# Altium project ECTU.PrjPcb
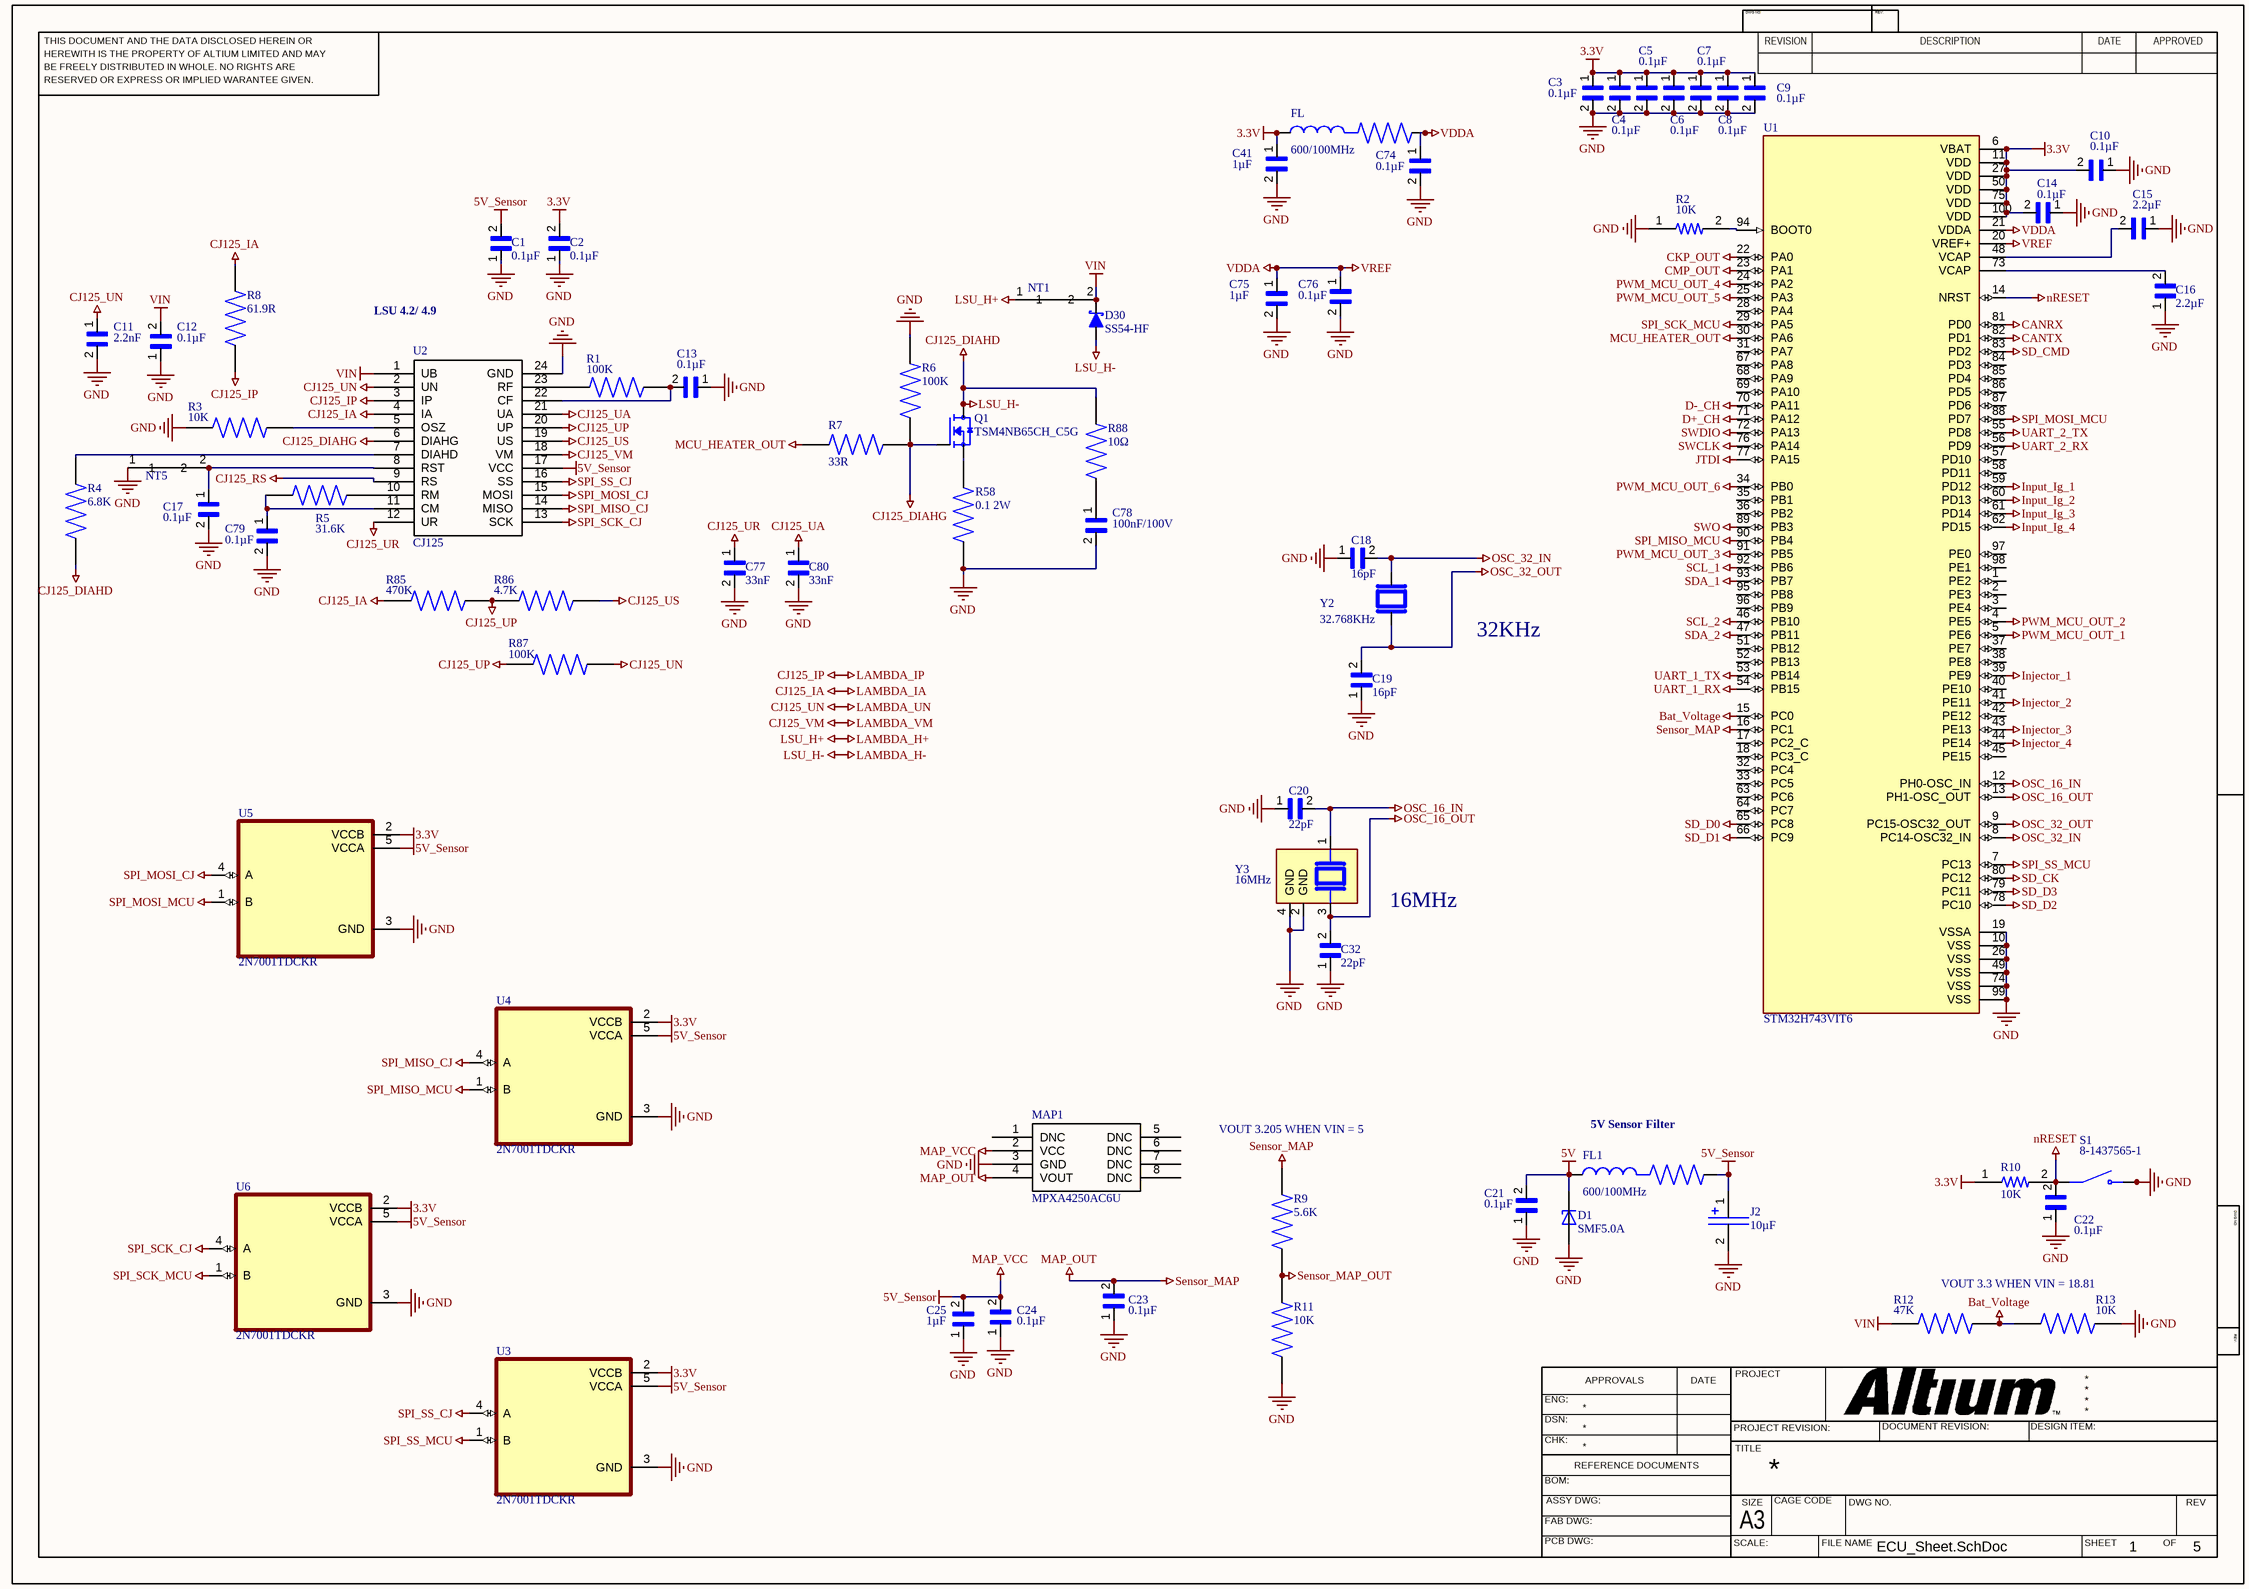
[diagram p0: ECU_Sheet.SchDoc]
5 sheets, 273 parts. Net scope: global (net labels, ports and power ports of the same name join across sheets).
Board file: ECTU_PCB.PcbDoc
Sheets:
  ECU_Sheet.SchDoc
  Communication_Interfaces.SchDoc
  Outputs_Sensors_And_ECUConnector.SchDoc
  Ignition_Injector.SchDoc
  CKP_CMP.SchDoc

## Sheet ECU_Sheet.SchDoc
size 420 x 297 mm; SheetNumber: 1; SheetTotal: 5

### Parts
C1  0.1µF  [CAPC1608X90N]
C2  0.1µF  [CAPC1608X90N]
C3  0.1µF  [CAPC1608X90N]
C4  0.1µF  [CAPC1608X90N]
C5  0.1µF  [CAPC1608X90N]
C6  0.1µF  [CAPC1608X90N]
C7  0.1µF  [CAPC1608X90N]
C8  0.1µF  [CAPC1608X90N]
C9  0.1µF  [CAPC1608X90N]
C10  0.1µF  [CAPC1608X90N]
C11  2.2nF  [CAPC1608X90N]
C12  0.1µF  [CAPC1608X90N]
C13  0.1µF  [CAPC1608X90N]
C14  0.1µF  [CAPC1608X90N]
C15  2.2µF  [CAPC1608X90N]
C16  2.2µF  [CAPC1608X90N]
C17  0.1µF  [CAPC1608X90N]
C18  16pF  [CAPC1608X90N]
C19  16pF  [CAPC1608X90N]
C20  22pF  [CAPC1608X90N]
C21  0.1µF  [CAPC1608X90N]
C22  0.1µF  [CAPC1608X90N]
C23  0.1µF  [CAPC1608X90N]
C24  0.1µF  [CAPC1608X90N]
C25  1µF  [CAPC1608X90N]
C32  22pF  [CAPC1608X90N]
C41  1µF  [CAPC1608X90N]
C74  0.1µF  [CAPC1608X90N]
C75  1µF  [CAPC1608X90N]
C76  0.1µF  [CAPC1608X90N]
C77  33nF  [CAPC1608X90N]
C78  100nF/100V  [CAPC1608X90N]
C79  0.1µF  [CAPC1608X90N]
C80  33nF  [CAPC1608X90N]
D1  SMF5.0A  [SODFL3718X102N]
D30  SS54-HF  [DIOM5025X220N]
FL  600/100MHz  [BEADC1608X95N]
FL1  600/100MHz  [BEADC1608X95N]
J2  10µF  [T491A106K010AT]
MAP1  MPXA4250AC6U  [SOIC127P1041X990-8N]
NT1  (no value)  [NetTie]  (net tie, no BOM)
NT5  NT  [NetTie]  (value not drawn)  (net tie, no BOM)
Q1  TSM4NB65CH_C5G  [TO228P680X240X837-3]
R1  100K  [RESC3116X65N]
R2  10K  [RESC1608X50N]
R3  10K  [RESC3116X65N]
R4  6.8K  [RESC3116X65N]
R5  31.6K  [RESC3116X65N]
R6  100K  [RESC3116X65N]
R7  33R  [RESC3116X65N]
R8  61.9R  [RESC3116X65N]
R9  5.6K  [RESC3116X65N]
R10  10K  [RESC1608X50N]
R11  10K  [RESC3116X65N]
R12  47K  [RESC3116X65N]
R13  10K  [RESC3116X65N]
R58  0.1 2W  [RESC6331X80N]
R85  470K  [RESC3116X65N]
R86  4.7K  [RESC3116X65N]
R87  100K  [RESC3116X65N]
R88  10Ω  [RESC3116X65N]
S1  8-1437565-1  [SW_8-1437565-1]
U1  STM32H743VIT6  [QFP50P1600X1600X160-100N]
U2  CJ125  [CJ125]
U3  2N7001TDCKR  [SOT65P210X110-5N]
U4  2N7001TDCKR  [SOT65P210X110-5N]
U5  2N7001TDCKR  [SOT65P210X110-5N]
U6  2N7001TDCKR  [SOT65P210X110-5N]
Y2  32.768KHz  [XTAL_ABS06-32.768KHZ-9-1-T]
Y3  16MHz  [XTAL_7M25090002]

### Nets
3.3V: C2.2 C3.1 C4.1 C5.1 C6.1 C7.1 C8.1 C9.1 C10.2 C14.2 C41.1 FL.1 R10.1 U1.6(VBAT) U1.11(VDD) U1.27(VDD) U1.50(VDD) U1.75(VDD) U1.100(VDD) U3.2(VCCB) U4.2(VCCB) U5.2(VCCB) U6.2(VCCB)
5V: C21.2 D1.C FL1.1
5V_Sensor: C1.2 C24.2 C25.2 FL1.2 J2.1(P$1) MAP1.2(VCC) U2.17(VCC) U3.5(VCCA) U4.5(VCCA) U5.5(VCCA) U6.5(VCCA)  [also labelled MAP_VCC]
Bat_Voltage: R12.2 R13.1 U1.15(PC0)
CANRX: U1.81(PD0)
CANTX: U1.82(PD1)
CJ125_DIAHD: D30.2(A) Q1.2(D) R4.1 R88.2  [also labelled LAMBDA_H-, LSU_H-]
CJ125_DIAHG: Q1.1(G) R6.1 R7.2 U2.6(DIAHG)
CJ125_IA: R8.1 R85.1 U2.4(IA)  [also labelled LAMBDA_IA]
CJ125_IP: R8.2 U2.3(IP)  [also labelled LAMBDA_IP]
CJ125_RS: U2.9(RS)
CJ125_UA: C80.1 U2.21(UA)
CJ125_UN: C11.1 R87.2 U2.2(UN)  [also labelled LAMBDA_UN]
CJ125_UP: R85.2 R86.1 R87.1 U2.20(UP)
CJ125_UR: C77.1 U2.12(UR)
CJ125_US: R86.2 U2.19(US)
CJ125_VM: U2.18(VM)  [also labelled LAMBDA_VM]
CKP_OUT: U1.22(PA0)
CMP_OUT: U1.23(PA1)
D+_CH: U1.71(PA12)
D-_CH: U1.70(PA11)
GND: C1.1 C2.1 C3.2 C4.2 C5.2 C6.2 C7.2 C8.2 C9.2 C10.1 C11.2 C12.1 C13.1 C14.1 C15.1 C16.1 C17.2 C18.1 C19.1 C20.1 C21.1 C22.1 C23.1 C24.1 C25.1 C32.1 C41.2 C74.2 C75.2 C76.2 C77.2 C78.2 C79.2 C80.2 D1.A J2.2(P$2) MAP1.3(GND) NT5.1 R2.1 R3.1 R6.2 R11.1 R13.2 R58.2 S1.3(NO) S1.4(NO) U1.10(VSS) U1.19(VSSA) U1.26(VSS) U1.49(VSS) U1.74(VSS) U1.99(VSS) U2.24(GND) U3.3(GND) U4.3(GND) U5.3(GND) U6.3(GND) Y3.2(GND) Y3.4(GND)
Injector_1: U1.39(PE9)
Injector_2: U1.41(PE11)
Injector_3: U1.43(PE13)
Injector_4: U1.44(PE14)
Input_Ig_1: U1.59(PD12)
Input_Ig_2: U1.60(PD13)
Input_Ig_3: U1.61(PD14)
Input_Ig_4: U1.62(PD15)
JTDI: U1.77(PA15)
LAMBDA_H+: NT1.1  [also labelled LSU_H+]
MAP_OUT: C23.2 MAP1.4(VOUT) R9.1 U1.16(PC1)  [also labelled Sensor_MAP]
MCU_HEATER_OUT: R7.1 U1.30(PA6)
nRESET: C22.2 R10.2 S1.1(COM) S1.2(COM) U1.14(NRST)
OSC_16_IN: C20.2 U1.12(PH0-OSC_IN) Y3.1
OSC_16_OUT: C32.2 U1.13(PH1-OSC_OUT) Y3.3
OSC_32_IN: C18.2 U1.8(PC14-OSC32_IN) Y2.2
OSC_32_OUT: C19.2 U1.9(PC15-OSC32_OUT) Y2.1
PWM_MCU_OUT_1: U1.5(PE6)
PWM_MCU_OUT_2: U1.4(PE5)
PWM_MCU_OUT_3: U1.91(PB5)
PWM_MCU_OUT_4: U1.24(PA2)
PWM_MCU_OUT_5: U1.25(PA3)
PWM_MCU_OUT_6: U1.34(PB0)
SCL_1: U1.92(PB6)
SCL_2: U1.46(PB10)
SD_CK: U1.80(PC12)
SD_CMD: U1.83(PD2)
SD_D0: U1.65(PC8)  [project net DATA_0]
SD_D1: U1.66(PC9)  [project net DATA_1]
SD_D2: U1.78(PC10)  [project net DATA_2]
SD_D3: U1.79(PC11)  [project net DATA_3]
SDA_1: U1.93(PB7)
SDA_2: U1.47(PB11)
Sensor_MAP_OUT: R9.2 R11.2
SPI_MISO_CJ: U2.14(MISO) U4.4(A)
SPI_MISO_MCU: U1.90(PB4) U4.1(B)
SPI_MOSI_CJ: U2.15(MOSI) U5.4(A)
SPI_MOSI_MCU: U1.88(PD7) U5.1(B)
SPI_SCK_CJ: U2.13(SCK) U6.4(A)
SPI_SCK_MCU: U1.29(PA5) U6.1(B)
SPI_SS_CJ: U2.16(SS) U3.4(A)
SPI_SS_MCU: U1.7(PC13) U3.1(B)
SWCLK: U1.76(PA14)
SWDIO: U1.72(PA13)
SWO: U1.89(PB3)
UART_1_RX: U1.54(PB15)
UART_1_TX: U1.53(PB14)
UART_2_RX: U1.56(PD9)
UART_2_TX: U1.55(PD8)
VDDA: C74.1 C75.1 C76.1 FL.2 U1.20(VREF+) U1.21(VDDA)  [also labelled VREF]
VIN: C12.2 D30.1(K) NT1.2 R12.1 U2.1(UB)
NetC13_2: C13.2 R1.2 U2.22(CF)
NetC15_2: C15.2 U1.48(VCAP)
NetC16_2: C16.2 U1.73(VCAP)
NetC17_1: C17.1 NT5.2 U2.8(RST)
NetC78_1: C78.1 R88.1
NetC79_1: C79.1 R5.1 U2.11(CM)
NetQ1_3: Q1.3(S) R58.1
NetR1_1: R1.1 U2.23(RF)
NetR2_2: R2.2 U1.94(BOOT0)
NetR3_2: R3.2 U2.5(OSZ)
NetR4_2: R4.2 U2.7(DIAHD)
NetR5_2: R5.2 U2.10(RM)

Not connected (* = marked no-connect by the designer): MAP1 1(DNC) 5(DNC) 6(DNC) 7(DNC) 8(DNC); U1 1(PE2) 2(PE3) 3(PE4) 17(PC2_C) 18(PC3_C) 28(PA4) 31(PA7) 32(PC4) 33(PC5) 35(PB1) 36(PB2) 37(PE7) 38(PE8) 40(PE10) 42(PE12) 45(PE15) 51(PB12) 52(PB13) 57(PD10) 58(PD11) 63(PC6) 64(PC7) 67(PA8) 68(PA9) 69(PA10) 84(PD3) 85(PD4) 86(PD5) 87(PD6) 95(PB8) 96(PB9) 97(PE0) 98(PE1)

### Notes on the sheet
- LSU 4.2/ 4.9
- 32KHz
- 16MHz
- VOUT 3.205 WHEN VIN = 5
- (near FL1) 5V Sensor Filter
- VOUT 3.3 WHEN VIN = 18.81
- THIS DOCUMENT AND THE DATA DISCLOSED HEREIN OR
- HEREWITH IS THE PROPERTY OF ALTIUM LIMITED AND MAY
- DWG NO:
- REVISION
- REV:
- DESCRIPTION
- DATE
- APPROVED
- BE FREELY DISTRIBUTED IN WHOLE. NO RIGHTS ARE
- RESERVED OR EXPRESS OR IMPLIED WARANTEE GIVEN.
- ENG:
- APPROVALS
- PROJECT
- DSN:
- CHK:
- REFERENCE DOCUMENTS
- PROJECT REVISION:
- TITLE
- DOCUMENT REVISION:
- DESIGN ITEM:
- BOM:
- FAB DWG:
- PCB DWG:
- ASSY DWG:
- SCALE:
- A3
- SIZE
- CAGE CODE
- FILE NAME
- DWG NO.
- SHEET
- OF
- REV

### Library data of the parts
C1-C25 C32 C41 C74-C80 = 06035C104MAZ2A: Multilayer Ceramic Capacitors MLCC - SMD/SMT; Package: None; Price: None; Value: *; MP: 06035C104MAZ2A; Availability: Unavailable
D1 = SMF5.0A: 200W, 6.7V, 5%, Unidirectional, TVS; MF: Taiwan Semiconductor; SnapEDA_Link: https://www.snapeda.com/parts/SMF5.0A/taiwan/view-part/?ref=snap; Package: SOD-123W-2 Taiwan Semiconductor; Value: *; MP: SMF5.0A; Check_prices: https://www.snapeda.com/parts/SMF5.0A/taiwan/view-part/?ref=eda
D30 = SS54-HF: Diode Schottky 40 V 5A Surface Mount DO-214AC (SMA); MF: Comchip Technology; SnapEDA_Link: https://www.snapeda.com/parts/SS54-HF/Comchip/view-part/?ref=snap; Package: DO-214AC-214 Comchip Technology; Value: *; MP: SS54-HF; Check_prices: https://www.snapeda.com/parts/SS54-HF/Comchip/view-part/?ref=eda
FL FL1 = BLM18DN601SZ1D: 600 Ohms @ 100MHz 1 Ferrite Bead 0603 _1608 Metric_ 700mA; MF: Murata; Package: 1608 Murata; Availability: Unavailable; Value: *; MP: BLM18DN601SZ1D; SnapEDA_Link: https://www.snapeda.com/parts/BLM18DN601SZ1D/Murata/view-part/4302620/?ref=snap; Price: None
J2 = T491A106K010AT: Condensador electrolÃ­tico de tantalio sÃ³lido MnO2 de 10 ÂµF, 10 V CC +/-10 %, serie T491 ¦ KEMET T491A106K010AT; SnapEDA_Link: https://www.snapeda.com/parts/T491A106K010AT/KEMET/view-part/?ref=snap; Package: SMD-2 KEMET; Value: *; MF: KEMET; MP: T491A106K010AT; Check_prices: https://www.snapeda.com/parts/T491A106K010AT/KEMET/view-part/?ref=eda
NT1 = NT
Q1 = TSM4NB65CH_C5G: 650V, 4A, Single N-Channel Power MOSFET; MF: Taiwan Semiconductor; MP: TSM4NB65CH C5G; SnapEDA_Link: https://www.snapeda.com/parts/TSM4NB65CH%20C5G/Taiwan+Semiconductor/view-part/?ref=snap; Package: TO-251 Taiwan Semiconductor; Value: *; Check_prices: https://www.snapeda.com/parts/TSM4NB65CH%20C5G/Taiwan+Semiconductor/view-part/?ref=eda
R1 R3-R9 R11-R13 R85-R88 = AA1206JR-07470RL: Package: None; Price: None; Value: *; MP: AA1206JR-07470RL; Availability: Unavailable
R2 R10 = RP73PF1J10KBTDF: Thin Film Resistors - SMD 10K OHM .1% 25PPM; Voltage_Rating: 75 V; Power_Rating: .166 W; MF: TE Connectivity; Mouser-Purchase-URL: https://snapeda.com/shop?store=Mouser&id=550687; Value: *; SnapEDA_Link: https://www.snapeda.com/parts/RP73PF1J10KBTDF/TE%20Connectivity%20Passive%20Product/view-part/550687/?ref=snap; MP: RP73PF1J10KBTDF; Tolerance: .1%; Digi-Key_Part_Number: A110204CT-ND; Resistance: 10K; Package: 0603
R58 = CRM2512-JX-R100ELF: Resistor,Thick Film,Res 0.1 Ohms,Pwr-Rtg 2 W,Tol 5%,SMT,2512 | Bourns CRM2512-JX-R100ELF; SnapEDA_Link: https://www.snapeda.com/parts/CRM2512-JX-R100ELF/Bourns/view-part/?ref=snap; Package: 6331 Bourns; Value: *; MF: Bourns; MP: CRM2512-JX-R100ELF; Check_prices: https://www.snapeda.com/parts/CRM2512-JX-R100ELF/Bourns/view-part/?ref=eda
U1 = STM32H743VIT6: ARMÂ® CortexÂ®-M7 STM32H7 Microcontroller IC 32-Bit Single-Core 480MHz 2MB (2M x 8) FLASH 100-LQFP (14x14); MF: STMicroelectronics; SnapEDA_Link: https://www.snapeda.com/parts/STM32H743VIT6/STMicroelectronics/view-part/?ref=snap; Package: LQFP-100 STMicroelectronics; Value: *; MP: STM32H743VIT6; Check_prices: https://www.snapeda.com/parts/STM32H743VIT6/STMicroelectronics/view-part/?ref=eda
U3-U6 = 2N7001TDCKR: 1-bit dual-supply buffered voltage signal converter; MF: Texas Instruments; SnapEDA_Link: https://www.snapeda.com/parts/2N7001TDCKR/Texas+Instruments/view-part/?ref=snap; Package: SC70-5 Texas Instruments; Value: *; MP: 2N7001TDCKR; Check_prices: https://www.snapeda.com/parts/2N7001TDCKR/Texas+Instruments/view-part/?ref=eda
Y2 = ABS06-32.768KHZ-9-1-T: 32.768 kHz Â±10ppm Crystal 9pF 90 kOhms 2-SMD, No Lead; MF: Abracon; Availability: In Stock; Value: *; Purchase-URL: https://pricing.snapeda.com/search/part/ABS06-32.768KHZ-9-1-T/?ref=eda; Price: None; Check_prices: https://www.snapeda.com/parts/ABS06-32.768KHZ-9-1-T/Abracon+LLC/view-part/?ref=eda; MP: ABS06-32.768KHZ-9-1-T; Package: SMD-2 Abracon LLC; SnapEDA_Link: https://www.snapeda.com/parts/ABS06-32.768KHZ-9-1-T/Abracon+LLC/view-part/?ref=snap
Y3 = 7M25090002: 25 MHz Â±10ppm Crystal 18pF 4-SMD, No Lead; MF: TXC; Availability: In Stock; Check_prices: https://www.snapeda.com/parts/7M25090002/TXC/view-part/?ref=eda; Price: None; SnapEDA_Link: https://www.snapeda.com/parts/7M25090002/TXC/view-part/?ref=snap; MP: 7M25090002; Value: *; Purchase-URL: https://pricing.snapeda.com/search/part/7M25090002/?ref=eda; Package: SMD-4 TXC
S1 = 8-1437565-1: Package: None; MP: 8-1437565-1; Price: None; Availability: Unavailable; Value: *

## Sheet Communication_Interfaces.SchDoc
size 420 x 297 mm; SheetNumber: 2; SheetTotal: 5
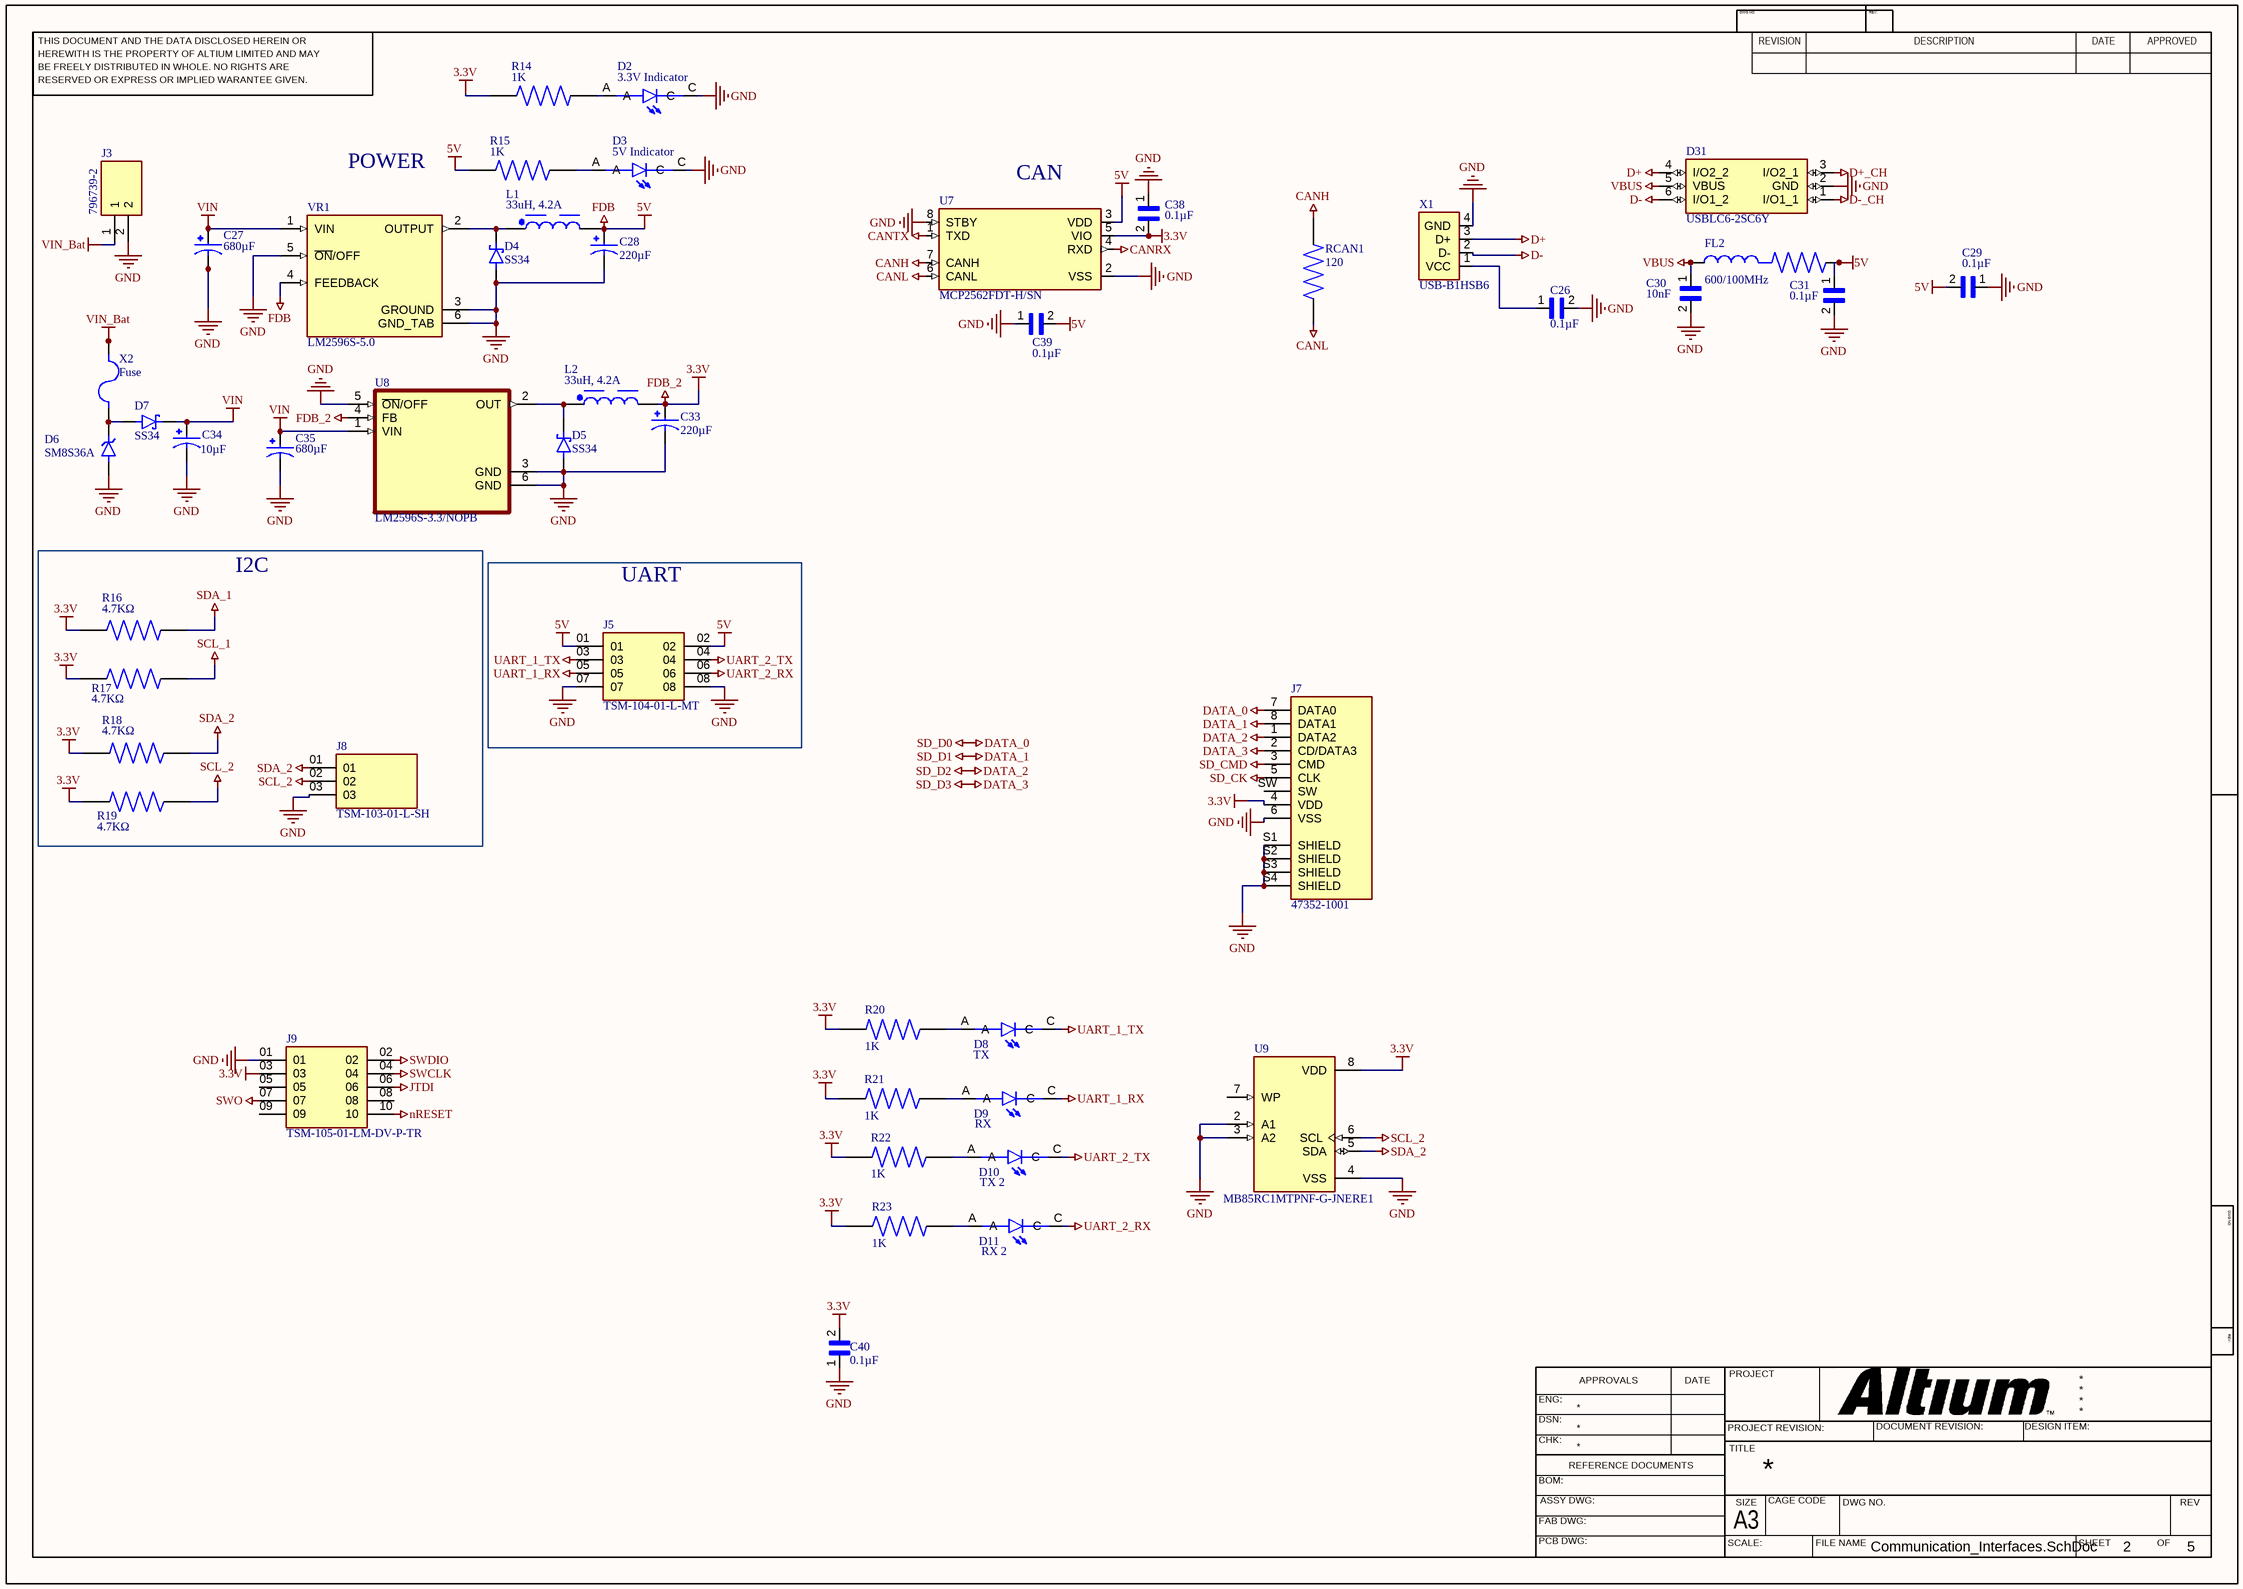
[diagram p1: Communication_Interfaces.SchDoc]

### Parts
C26  0.1µF  [CAPC1608X90N]
C27  680µF  [CAP_EEEFN1E681UV]
C28  220µF  [CAP_EEEFP1V221AV]
C29  0.1µF  [CAPC1608X90N]
C30  10nF  [CAPC1608X90N]
C31  0.1µF  [CAPC1608X90N]
C33  220µF  [CAP_EEEFP1V221AV]
C34  10µF  [CAPPRD500W50D500H1100]
C35  680µF  [CAP_EEEFN1E681UV]
C38  0.1µF  [CAPC1608X90N]
C39  0.1µF  [CAPC1608X90N]
C40  0.1µF  [CAPC1608X90N]
D2  3.3V Indicator  [LEDC2012X70N]
D3  5V Indicator  [LEDC2012X70N]
D4  SS34  [DIO_SS34]
D5  SS34  [DIO_SS34]
D6  SM8S36A  [TVSP_SM8S36A]
D7  SS34  [DIO_SS34]
D8  TX  [LEDC2012X70N]
D9  RX  [LEDC2012X70N]
D10  TX 2  [LEDC2012X70N]
D11  RX 2  [LEDC2012X70N]
D31  USBLC6-2SC6Y  [SOT95P280X145-6N]
FL2  600/100MHz  [BEADC1608X95N]
J3  796739-2  [TE_796739-2]
J5  TSM-104-01-L-MT  [SAMTEC_TSM-104-01-L-MT]
J7  47352-1001  [MOLEX_47352-1001]
J8  TSM-103-01-L-SH  [SAMTEC_TSM-103-01-L-SH]
J9  TSM-105-01-LM-DV-P-TR  [SAMTEC_TSM-105-01-LM-DV-P-TR]
L1  33uH, 4.2A  [WE-PD_1210]
L2  33uH, 4.2A  [WE-PD_1210]
R14  1K  [RESC3116X65N]
R15  1K  [RESC3116X65N]
R16  4.7KΩ  [RES_ERJS06J472V]
R17  4.7KΩ  [RES_ERJS06J472V]
R18  4.7KΩ  [RES_ERJS06J472V]
R19  4.7KΩ  [RES_ERJS06J472V]
R20  1K  [RESC3116X65N]
R21  1K  [RESC3116X65N]
R22  1K  [RESC3116X65N]
R23  1K  [RESC3116X65N]
RCAN1  120  [RESC3116X65N]
U7  MCP2562FDT-H/SN  [SOIC127P600X175-8N]
U8  LM2596S-3.3/NOPB  [VREG_LM2596S-3.3/NOPB]
U9  MB85RC1MTPNF-G-JNERE1  [SOIC127P600X175-8N]
VR1  LM2596S-5.0  [TO170P1524X483-6N]
X1  USB-B1HSB6  [OST_USB-B1HSB6]
X2  Fuse  [FUSE_3522-2]

### Blocks framed on the sheet
I2C: J8 R16-R19
UART: J5

### Nets
3.3V: C33.1 C38.2 C40.2 J7.4(VDD) J9.03 L2.2 R14.1 R16.2 R17.1 R18.2 R19.1 R20.1 R21.1 R22.1 R23.1 U7.5(VIO) U8.4(FB) U9.8(VDD)  [also labelled FDB_2]
5V: C28.1 C29.2 C31.1 C39.2 FL2.2 J5.01 J5.02 L1.2 R15.1 U7.3(VDD) VR1.4(FEEDBACK)  [also labelled FDB]
CANH: RCAN1.2 U7.7(CANH)
CANL: RCAN1.1 U7.6(CANL)
CANRX: U7.4(RXD)
CANTX: U7.1(TXD)
D+: D31.4(I/O2_2) X1.3(D+)
D+_CH: D31.3(I/O2_1)
D-: D31.6(I/O1_2) X1.2(D-)
D-_CH: D31.1(I/O1_1)
DATA_0: J7.7(DATA0)  [also labelled SD_D0]
DATA_1: J7.8(DATA1)  [also labelled SD_D1]
DATA_2: J7.1(DATA2)  [also labelled SD_D2]
DATA_3: J7.2(CD/DATA3)  [also labelled SD_D3]
GND: C26.2 C27.2 C28.2 C29.1 C30.2 C31.2 C33.2 C34.N C35.2 C38.1 C39.1 C40.1 D2.C D3.C D4.A D5.A D6.2(A) D31.2(GND) J3.2 J5.07 J5.08 J7.6(VSS) J7.S1(SHIELD) J7.S2(SHIELD) J7.S3(SHIELD) J7.S4(SHIELD) J8.03 J9.01 U7.2(VSS) U7.8(STBY) U8.3(GND) U8.5(~{ON}/OFF) U8.6(GND) U9.2(A1) U9.3(A2) U9.4(VSS) VR1.3(GROUND) VR1.5(~{ON}/OFF) VR1.6(GND_TAB) X1.4(GND)
JTDI: J9.06
nRESET: J9.10
SCL_1: R17.2
SCL_2: J8.02 R19.2 U9.6(SCL)
SD_CK: J7.5(CLK)
SD_CMD: J7.3(CMD)
SDA_1: R16.1
SDA_2: J8.01 R18.1 U9.5(SDA)
SWCLK: J9.04
SWDIO: J9.02
SWO: J9.07
UART_1_RX: D9.C J5.05
UART_1_TX: D8.C J5.03
UART_2_RX: D11.C J5.06
UART_2_TX: D10.C J5.04
VBUS: C30.1 D31.5(VBUS) FL2.1
VIN: C27.1 C34.P C35.1 D7.C(K) U8.1(VIN) VR1.1(VIN)
VIN_Bat: J3.1 X2.2A X2.2B
NetC26_1: C26.1 X1.1(VCC)
NetD2_A: D2.A R14.2
NetD3_A: D3.A R15.2
NetD4_C: D4.C(K) L1.1 VR1.2(OUTPUT)
NetD5_C: D5.C(K) L2.1 U8.2(OUT)
NetD6_1: D6.1(K) D7.A X2.1A X2.1B
NetD8_A: D8.A R20.2
NetD9_A: D9.A R21.2
NetD10_A: D10.A R22.2
NetD11_A: D11.A R23.2

Not connected (* = marked no-connect by the designer): J7 SW; J9 05 08 09; U9 7(WP)

### Notes on the sheet
- (near VR1) POWER
- (near U7) CAN
- THIS DOCUMENT AND THE DATA DISCLOSED HEREIN OR
- HEREWITH IS THE PROPERTY OF ALTIUM LIMITED AND MAY
- DWG NO:
- REVISION
- REV:
- DESCRIPTION
- DATE
- APPROVED
- BE FREELY DISTRIBUTED IN WHOLE. NO RIGHTS ARE
- RESERVED OR EXPRESS OR IMPLIED WARANTEE GIVEN.
- ENG:
- APPROVALS
- PROJECT
- DSN:
- CHK:
- REFERENCE DOCUMENTS
- PROJECT REVISION:
- TITLE
- DOCUMENT REVISION:
- DESIGN ITEM:
- BOM:
- FAB DWG:
- PCB DWG:
- ASSY DWG:
- SCALE:
- A3
- SIZE
- CAGE CODE
- FILE NAME
- DWG NO.
- SHEET
- OF
- REV

### Library data of the parts
C26 C29-C31 C38-C40 = 06035C104MAZ2A: as C1 on sheet ECU_Sheet; Package: None; Price: None; Value: *; MP: 06035C104MAZ2A; Availability: Unavailable
C27 C35 = EEEFN1E681UV: CAP ALUM 680UF 20% 25V SMD; MF: Panasonic Electronic Components; MP: EEE-FN1E681UV; Value: *; Purchase-URL: https://pricing.snapeda.com/search/part/EEE-FN1E681UV/?ref=eda; Price: None; Check_prices: https://www.snapeda.com/parts/EEE-FN1E681UV/Panasonic/view-part/6178425/?ref=eda; Package: RADIAL-2 Panasonic; Availability: In Stock; SnapEDA_Link: https://www.snapeda.com/parts/EEE-FN1E681UV/Panasonic/view-part/6178425/?ref=snap
C28 C33 = EEEFP1V221AV: CAP ALUM 220UF 20% 35V SMD; MF: Panasonic Electronic Components; MP: EEE-FP1V221AV; SnapEDA_Link: https://www.snapeda.com/parts/EEE-FP1V221AV/Panasonic/view-part/4900934/?ref=snap; Price: None; Availability: Not in stock; Value: *; Check_prices: https://www.snapeda.com/parts/EEE-FP1V221AV/Panasonic/view-part/4900934/?ref=eda; Package: RADIAL-2 Panasonic
C34 = ECEA1EN100UB: 10ÂµF 25V Aluminum Electrolytic Capacitors Radial, Can 2000 Hrs @ 85Â°C; MF: Panasonic; SnapEDA_Link: https://www.snapeda.com/parts/ECEA1EN100UB/Panasonic/view-part/?ref=snap; Price: None; Check_prices: https://www.snapeda.com/parts/ECEA1EN100UB/Panasonic/view-part/?ref=eda; Purchase-URL: https://pricing.snapeda.com/search/part/ECEA1EN100UB/?ref=eda; Package: RADIAL-2 Panasonic; MP: ECEA1EN100UB; Value: *; Availability: In Stock
D2 D3 D8-D11 = 597-3305-607F: LED Uni-Color Green 4-Pin Chip 0805 T/R; Availability: Unavailable; Value: *; Price: None; MP: 597-3305-607F; Package: None
D4 D5 D7 = SS34: 3A, 40V, Schottky Rectifier; MF: Taiwan Semiconductor; Package: DO-214AB-2 Taiwan Semiconductor; Value: *; MP: SS34
  D4 D5: SnapEDA_Link: https://www.snapeda.com/parts/SS34/Taiwan+Semiconductor/view-part/?ref=snap; Check_prices: https://www.snapeda.com/parts/SS34/Taiwan+Semiconductor/view-part/?ref=eda
  D7: SnapEDA_Link: https://www.snapeda.com/parts/SS34/taiwan/view-part/?ref=snap; Check_prices: https://www.snapeda.com/parts/SS34/taiwan/view-part/?ref=eda
D31 = USBLC6-2SC6Y: 17V Clamp 5A (8/20µs) Ipp Tvs Diode Surface Mount SOT-23-6; MF: STMicroelectronics; SnapEDA_Link: https://www.snapeda.com/parts/USBLC6-2SC6Y/STMicroelectronics/view-part/?ref=snap; Package: SOT-23-6 STMicroelectronics; Value: *; MP: USBLC6-2SC6Y; Check_prices: https://www.snapeda.com/parts/USBLC6-2SC6Y/STMicroelectronics/view-part/?ref=eda
FL2 = BLM18DN601SZ1D: as FL on sheet ECU_Sheet; Package: 1608 Murata; Availability: Unavailable; Value: *; MP: BLM18DN601SZ1D; SnapEDA_Link: https://www.snapeda.com/parts/BLM18DN601SZ1D/Murata/view-part/4302620/?ref=snap; Price: None
J3 = 796739-2: Conn Terminal Block F 2 POS 9.53mm Solder RA Thru-Hole 32A/Contact; MF: TE Connectivity; Number_of_Positions: 2; Centerline_Pitch: 9.53 mm[.375 in]; Package: None; Value: *; Price: None; EU_RoHS_Compliance: Compliant with Exemptions; MP: 796739-2; TE_purchase_URL: https://www.te.com/usa-en/product-796739-2.html?te_bu=Cor&te_type=disp&te_campaign=seda_glo_cor-seda-global-disp-prtnr-fy19-seda-model-bom-cta_sma-317_1&elqCampaignId=32493; Availability: Unavailable; SnapEDA_Link: https://www.snapeda.com/parts/796739-2/TE%20Connectivity%20AMP%20Connectors/view-part/279084/?ref=snap
J5 = TSM-104-01-L-MT: TSM Series .100 Surface Mount Terminal Strip; MF: Samtec; SnapEDA_Link: https://www.snapeda.com/parts/TSM-104-01-L-MT/Samtec/view-part/?ref=snap; Package: None; Value: *; MP: TSM-104-01-L-MT; Check_prices: https://www.snapeda.com/parts/TSM-104-01-L-MT/Samtec/view-part/?ref=eda
J7 = 47352-1001: 8 (6 + 2) Position Card Connector Secure Digital - microSDâ„¢ Surface Mount, Right Angle Gold; MP: 473521001; MF: Molex; Price: None; Availability: In Stock; Package: None; Value: *; Purchase-URL: https://pricing.snapeda.com/search/part/473521001/?ref=eda
J8 = TSM-103-01-L-SH: MF: Samtec Inc.; Package: None; MP: TSM-103-01-L-SH; Value: *; Price: None; Availability: Unavailable
J9 = TSM-105-01-LM-DV-P-TR: TSM - Samtec 2.54mm Dual Row Vertical Surface Mount Header 5.84mm Post Height (01) - Fast Stock; Check_prices: https://www.snapeda.com/parts/TSM-105-01-LM-DV-P-TR/Samtec/view-part/3284031/?ref=eda; MF: Samtec; Package: None; Purchase-URL: https://pricing.snapeda.com/search/part/TSM-105-01-LM-DV-P-TR/?ref=eda; Availability: In Stock; Value: *; MP: TSM-105-01-LM-DV-P-TR; SnapEDA_Link: https://www.snapeda.com/parts/TSM-105-01-LM-DV-P-TR/Samtec/view-part/3284031/?ref=snap; Price: None
L1 L2 = 7447709330: WE-PD SMT Power Inductor, size 1210, 33uH, 4.2A, 45mOhm; Manufacturer: Wurth Elektronik; Case/Size Code: 1210; DC Resistance: 37mOhm; Saturation Current: 5.5A; Self Resonant Frequency: 8.5MHz; Type: Standard; Manufacturer Part Number: 7447709330; Category: Power Inductors; Match Code: WE-PD; ComponentLink1Description: Website Link; ComponentLink1URL: https://www.we-online.com/redexpert/article/7447709330?ad; ComponentLink2Description: Datasheet Link; ComponentLink2URL: https://www.we-online.com/redexpert/spec/7447709330?ad; Mount: Surface Mount; Operating Temperature Max: 125°C; Operating Temperature Min: -40°C; Packaging: Tape and Reel; Length: 12mm; Width: 12mm; Height: 10mm; DC Resistance Max: 45mOhm; Inductance: 33uH; Rated Current: 4.2A
R14 R15 R20-R23 = RC1206JR-071KL: RES, THICK FILM, 1K, 5%, 0.25W, 1206; Resistance:1kohm; Resistance Tolerance:Â± 5%; Power Rating:250mW; Resistor Case Style:1206 ^3216 Metric]; Resistor Technology:Thick Film; Resistor Type:General Purpose; Product Range:RC Series; MF: Yageo Corporation; MP: RC1206JR071KL; SnapEDA_Link: https://www.snapeda.com/parts/RC1206JR071KL/Yageo/view-part/?ref=snap; Package: 1206-2 YAGEO; Value: *; Check_prices: https://www.snapeda.com/parts/RC1206JR071KL/Yageo/view-part/?ref=eda
R16-R19 = ERJS06J472V: Price: None; Availability: Unavailable; MP: ERJS06J472V; Package: None; Value: *
RCAN1 = AA1206JR-07470RL: Package: None; Price: None; Value: *; MP: AA1206JR-07470RL; Availability: Unavailable
U7 = MCP2562FDT-H/SN: CAN Flexible Data Rate Transceiver | Microchip Technology Inc. MCP2562FDT-H/SN; SnapEDA_Link: https://www.snapeda.com/parts/MCP2562FDT-H/SN/Microchip/view-part/?ref=snap; Package: SO-8 Microchip; Value: *; MF: Microchip; MP: MCP2562FDT-H/SN; Check_prices: https://www.snapeda.com/parts/MCP2562FDT-H/SN/Microchip/view-part/?ref=eda
U9 = MB85RC1MTPNF-G-JNERE1: FRAM _Ferroelectric RAM_ Memory IC 1Mb _128K x 8_ IÂ²C 3.4MHz 130ns 8-SOP; MF: Fujitsu Electronics; MP: MB85RC1MTPNF-G-JNERE1; Price: None; SnapEDA_Link: https://www.snapeda.com/parts/MB85RC1MTPNF-G-JNERE1/Fujitsu%20Electronics%20America%2C%20Inc./view-part/2842124/?ref=snap; Availability: Unavailable; Value: *; Package: SO-8 Fujitsu
VR1 = LM2596S-5.0: SIMPLE SWITCHER&reg; 4.5V to 40V, 3A Low Component Count Step-Down Regulator; MP: LM2596S-5.0/NOPB; MF: Texas Instruments; Price: None; Availability: In Stock; Package: TO-263-5 Texas Instruments; SnapEDA_Link: https://www.snapeda.com/parts/LM2596S-5.0/NOPB/Texas+Instruments/view-part/?ref=snap; Check_prices: https://www.snapeda.com/parts/LM2596S-5.0/NOPB/Texas+Instruments/view-part/?ref=eda; Value: *; Purchase-URL: https://pricing.snapeda.com/search/part/LM2596S-5.0/NOPB/?ref=eda
X1 = USB-B1HSB6: USB-B (USB TYPE-B) - Receptacle Connector 4 Position Through Hole, Right Angle; MF: On Shore; Check_prices: https://www.snapeda.com/parts/USB-B1HSB6/On+Shore+Technology+Inc./view-part/?ref=eda; Value: *; Purchase-URL: https://pricing.snapeda.com/search/part/USB-B1HSB6/?ref=eda; Price: None; MP: USB-B1HSB6; SnapEDA_Link: https://www.snapeda.com/parts/USB-B1HSB6/On+Shore+Technology+Inc./view-part/?ref=snap; Availability: In Stock; Package: None
X2 = 3522-2: MF: {'manufacturer': u'Keystone Electronics'}; Availability: Unavailable; Price: None; Value: *; MP: 3522-2; Package: None
D6 = SM8S36A: Package: None; Price: None; Value: *; MP: SM8S36A; Availability: Unavailable
U8 = LM2596S-3.3/NOPB: MP: LM2596S-3.3/NOPB; Availability: Unavailable; Package: None; Value: *; Price: None

## Sheet Outputs_Sensors_And_ECUConnector.SchDoc
size A2; SheetNumber: 3; SheetTotal: 5
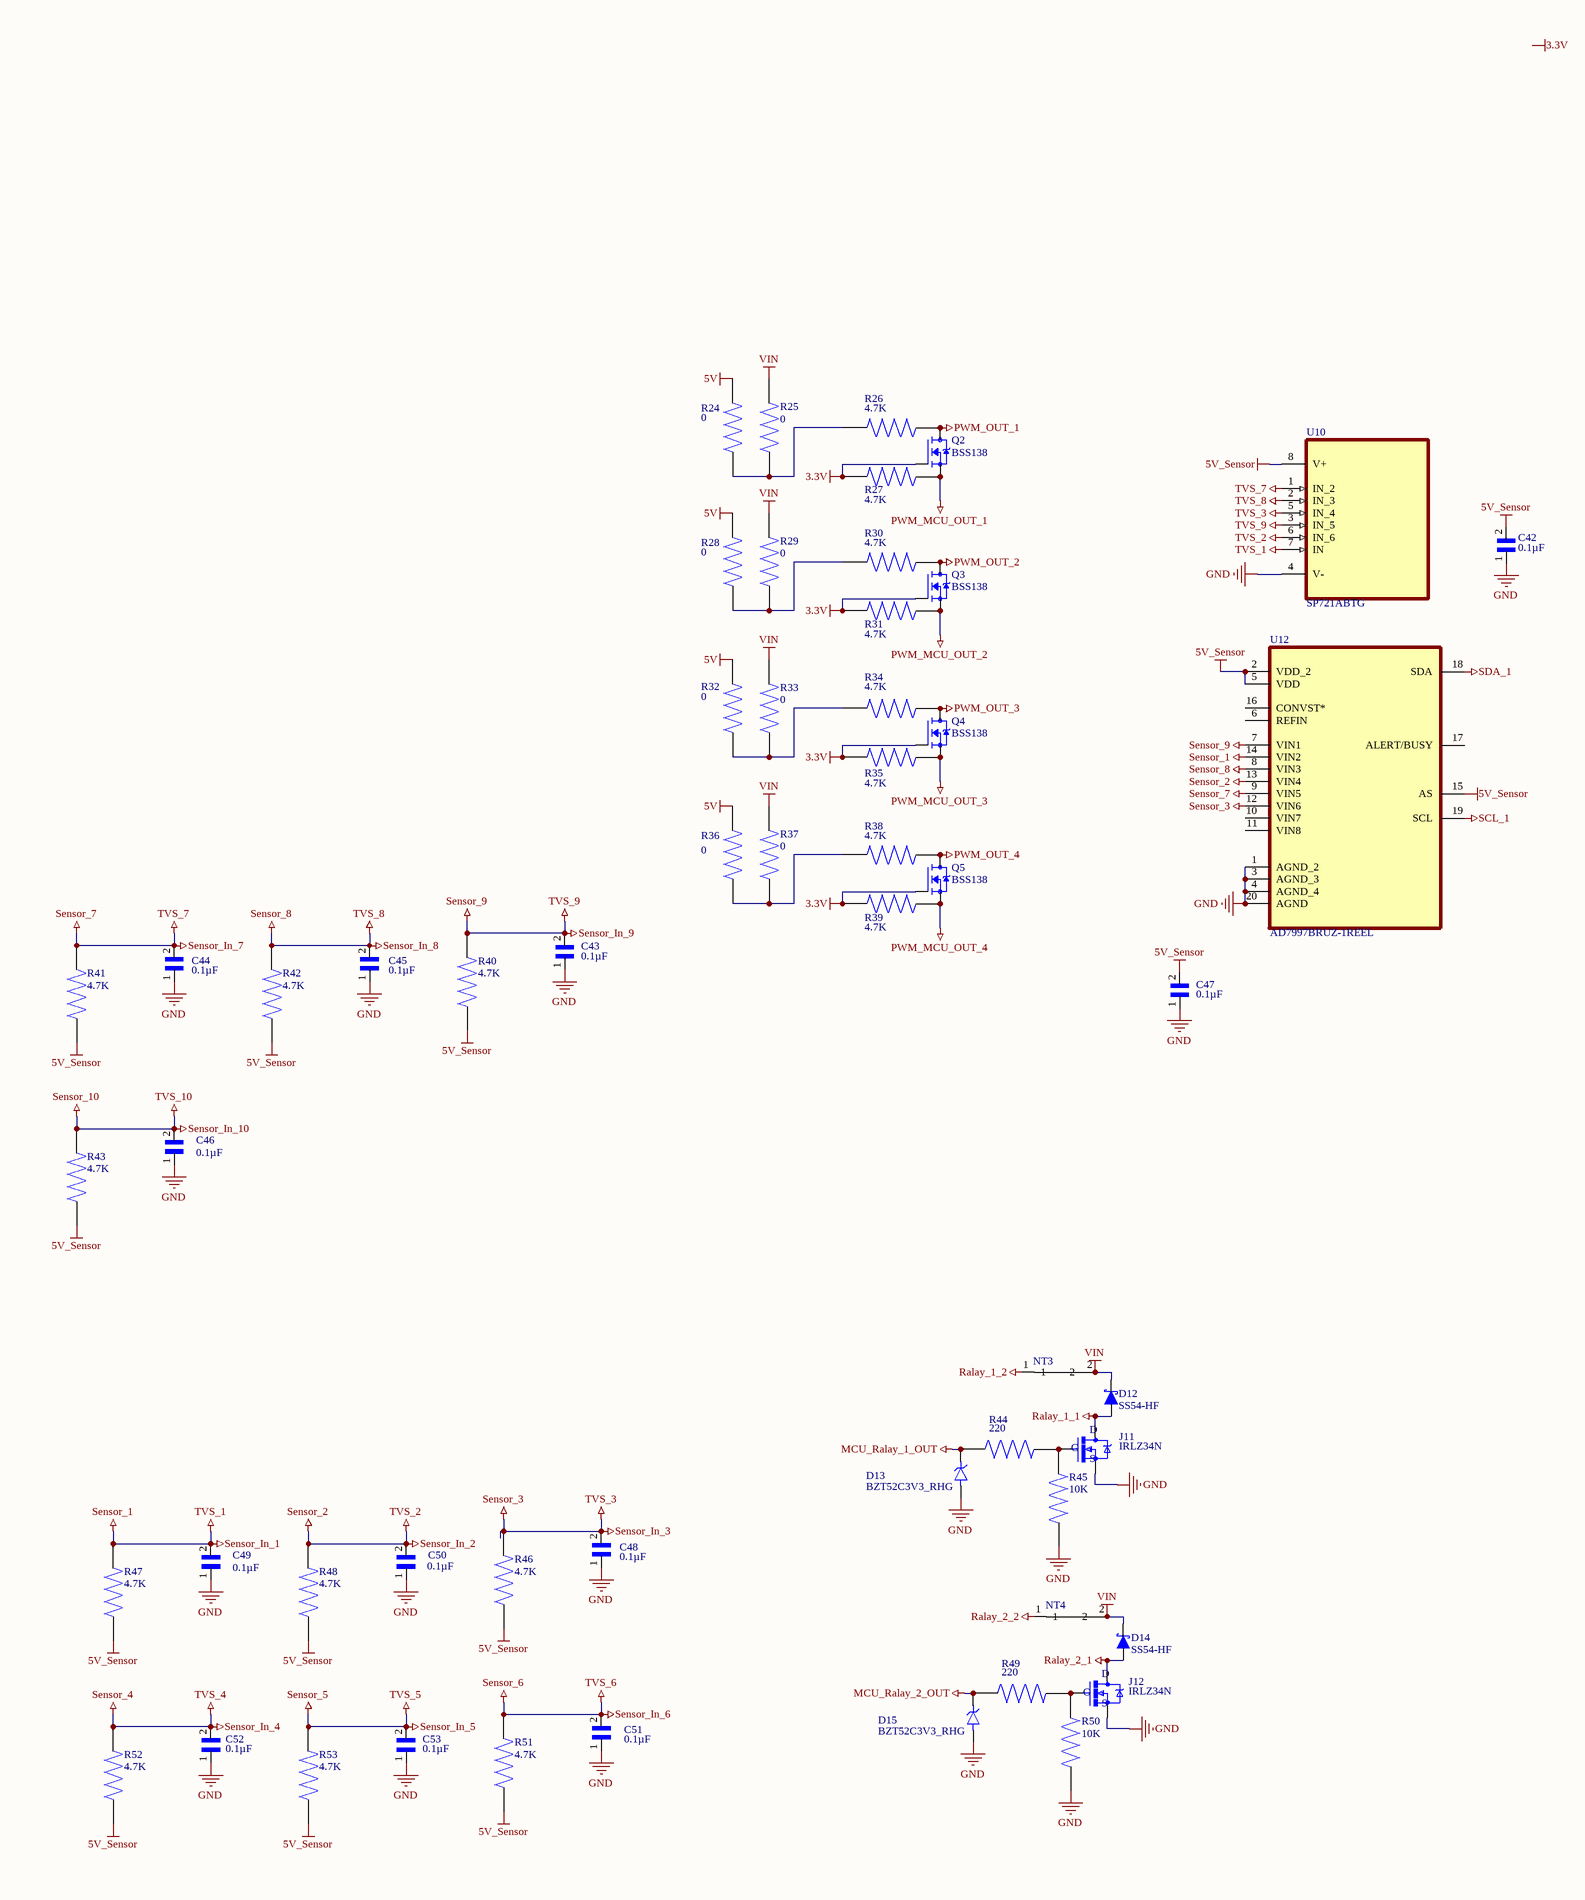
[diagram p2: Outputs_Sensors_And_ECUConnector.SchDoc, left]
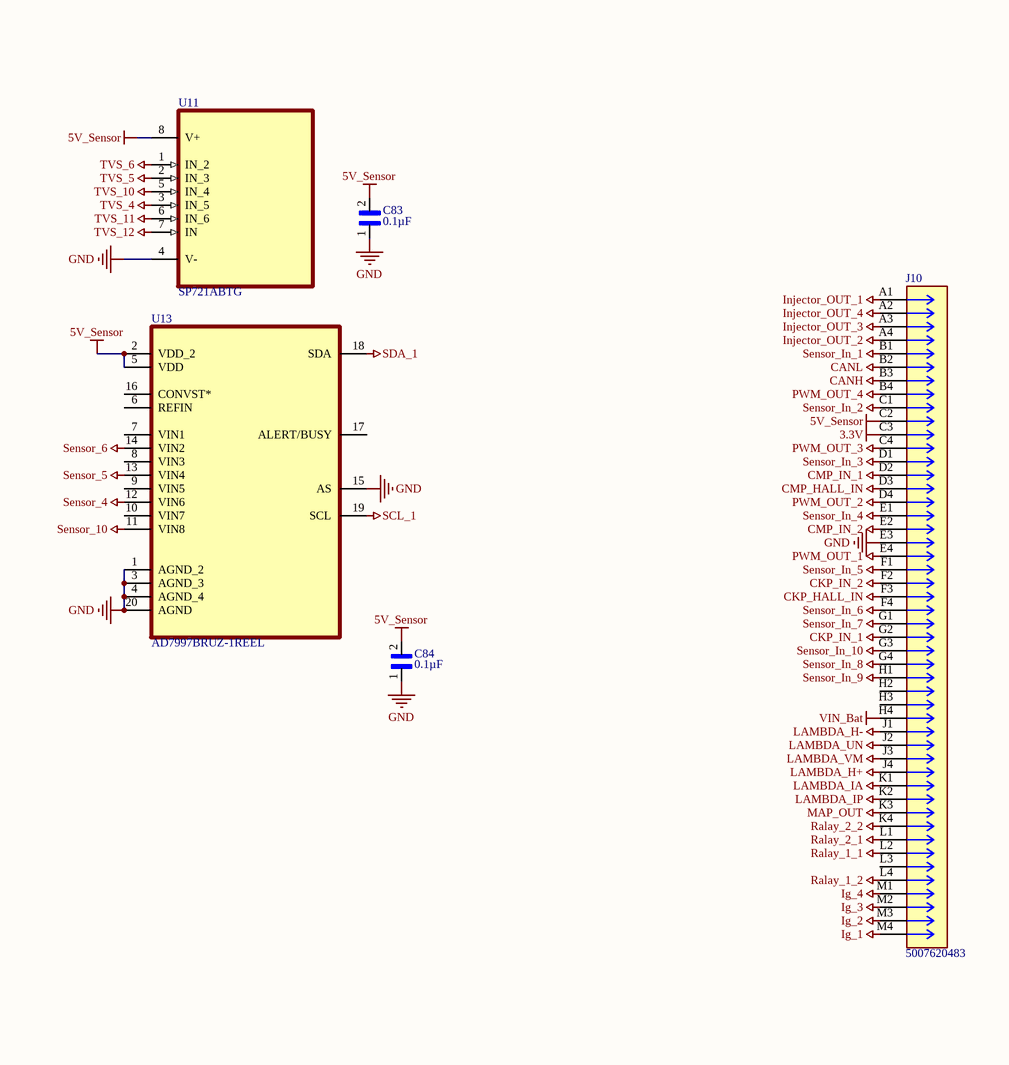
[diagram p3: Outputs_Sensors_And_ECUConnector.SchDoc, right]

### Parts
C42  0.1µF  [CAPC1608X90N]
C43  0.1µF  [CAPC1608X90N]
C44  0.1µF  [CAPC1608X90N]
C45  0.1µF  [CAPC1608X90N]
C46  0.1µF  [CAPC1608X90N]
C47  0.1µF  [CAPC1608X90N]
C48  0.1µF  [CAPC1608X90N]
C49  0.1µF  [CAPC1608X90N]
C50  0.1µF  [CAPC1608X90N]
C51  0.1µF  [CAPC1608X90N]
C52  0.1µF  [CAPC1608X90N]
C53  0.1µF  [CAPC1608X90N]
C83  0.1µF  [CAPC1608X90N]
C84  0.1µF  [CAPC1608X90N]
D12  SS54-HF  [DIOM5025X220N]
D13  BZT52C3V3_RHG  [DIO_BZT52C3V3_RHG]
D14  SS54-HF  [DIOM5025X220N]
D15  BZT52C3V3_RHG  [DIO_BZT52C3V3_RHG]
J10  5007620483  [CONN_SD-500762-001_MOL]
J11  IRLZ34N  [TO-220(2)]
J12  IRLZ34N  [TO-220(2)]
NT3  NT  [NetTie]  (value not drawn)  (net tie, no BOM)
NT4  NT  [NetTie]  (value not drawn)  (net tie, no BOM)
Q2  BSS138  [SOT95P240X111-3N]
Q3  BSS138  [SOT95P240X111-3N]
Q4  BSS138  [SOT95P240X111-3N]
Q5  BSS138  [SOT95P240X111-3N]
R24  0  [RESC3116X65N]
R25  0  [RESC3116X65N]
R26  4.7K  [RESC3116X65N]
R27  4.7K  [RESC3116X65N]
R28  0  [RESC3116X65N]
R29  0  [RESC3116X65N]
R30  4.7K  [RESC3116X65N]
R31  4.7K  [RESC3116X65N]
R32  0  [RESC3116X65N]
R33  0  [RESC3116X65N]
R34  4.7K  [RESC3116X65N]
R35  4.7K  [RESC3116X65N]
R36  0  [RESC3116X65N]
R37  0  [RESC3116X65N]
R38  4.7K  [RESC3116X65N]
R39  4.7K  [RESC3116X65N]
R40  4.7K  [RESC3116X65N]
R41  4.7K  [RESC3116X65N]
R42  4.7K  [RESC3116X65N]
R43  4.7K  [RESC3116X65N]
R44  220  [RESC3116X65N]
R45  10K  [RESC3116X65N]
R46  4.7K  [RESC3116X65N]
R47  4.7K  [RESC3116X65N]
R48  4.7K  [RESC3116X65N]
R49  220  [RESC3116X65N]
R50  10K  [RESC3116X65N]
R51  4.7K  [RESC3116X65N]
R52  4.7K  [RESC3116X65N]
R53  4.7K  [RESC3116X65N]
U10  SP721ABTG  [SOIC127P600X175-8N]
U11  SP721ABTG  [SOIC127P600X175-8N]
U12  AD7997BRUZ-1REEL  [SOP65P640X120-20N]
U13  AD7997BRUZ-1REEL  [SOP65P640X120-20N]

### Nets
3.3V: J10.C3 Q2.1(G) Q3.1(G) Q4.1(G) Q5.1(G) R27.2 R31.2 R35.2 R39.2
5V: R24.2 R28.2 R32.2 R36.2
5V_Sensor: C42.2 C47.2 C83.2 C84.2 J10.C2 R40.1 R41.1 R42.1 R43.1 R46.1 R47.1 R48.1 R51.1 R52.1 R53.1 U10.8(V+) U11.8(V+) U12.2(VDD_2) U12.5(VDD) U12.15(AS) U13.2(VDD_2) U13.5(VDD)
CANH: J10.B3
CANL: J10.B2
CKP_HALL_IN: J10.F3
CKP_IN_1: J10.G2
CKP_IN_2: J10.F2
CMP_HALL_IN: J10.D3
CMP_IN_1: J10.D2
CMP_IN_2: J10.E2
GND: C42.1 C43.1 C44.1 C45.1 C46.1 C47.1 C48.1 C49.1 C50.1 C51.1 C52.1 C53.1 C83.1 C84.1 D13.A D15.A J10.E3 J11.OUT(S) J12.OUT(S) R45.2 R50.2 U10.4(V-) U11.4(V-) U12.1(AGND_2) U12.3(AGND_3) U12.4(AGND_4) U12.20(AGND) U13.1(AGND_2) U13.3(AGND_3) U13.4(AGND_4) U13.15(AS) U13.20(AGND)
Ig_1: J10.M4
Ig_2: J10.M3
Ig_3: J10.M2
Ig_4: J10.M1
Injector_OUT_1: J10.A1
Injector_OUT_2: J10.A4
Injector_OUT_3: J10.A3
Injector_OUT_4: J10.A2
LAMBDA_H+: J10.J4
LAMBDA_H-: J10.J1  [project net CJ125_DIAHD]
LAMBDA_IA: J10.K1  [project net CJ125_IA]
LAMBDA_IP: J10.K2  [project net CJ125_IP]
LAMBDA_UN: J10.J2  [project net CJ125_UN]
LAMBDA_VM: J10.J3  [project net CJ125_VM]
MAP_OUT: J10.K3
MCU_Ralay_1_OUT: D13.C(K) R44.1
MCU_Ralay_2_OUT: D15.C(K) R49.1
PWM_MCU_OUT_1: Q2.2(S) R27.1
PWM_MCU_OUT_2: Q3.2(S) R31.1
PWM_MCU_OUT_3: Q4.2(S) R35.1
PWM_MCU_OUT_4: Q5.2(S) R39.1
PWM_OUT_1: J10.E4 Q2.3(D) R26.1
PWM_OUT_2: J10.D4 Q3.3(D) R30.1
PWM_OUT_3: J10.C4 Q4.3(D) R34.1
PWM_OUT_4: J10.B4 Q5.3(D) R38.1
Ralay_1_1: D12.2(A) J10.L2 J11.GND(D)
Ralay_1_2: J10.L4 NT3.1
Ralay_2_1: D14.2(A) J10.L1 J12.GND(D)
Ralay_2_2: J10.K4 NT4.1
SCL_1: U12.19(SCL) U13.19(SCL)
SDA_1: U12.18(SDA) U13.18(SDA)
Sensor_1: C49.2 J10.B1 R47.2 U10.7(IN) U12.14(VIN2)  [also labelled Sensor_In_1, TVS_1]
Sensor_2: C50.2 J10.C1 R48.2 U10.6(IN_6) U12.13(VIN4)  [also labelled Sensor_In_2, TVS_2]
Sensor_3: C48.2 J10.D1 R46.2 U10.5(IN_4) U12.12(VIN6)  [also labelled Sensor_In_3, TVS_3]
Sensor_4: C52.2 J10.E1 R52.2 U11.3(IN_5) U13.12(VIN6)  [also labelled Sensor_In_4, TVS_4]
Sensor_5: C53.2 J10.F1 R53.2 U11.2(IN_3) U13.13(VIN4)  [also labelled Sensor_In_5, TVS_5]
Sensor_6: C51.2 J10.F4 R51.2 U11.1(IN_2) U13.14(VIN2)  [also labelled Sensor_In_6, TVS_6]
Sensor_7: C44.2 J10.G1 R41.2 U10.1(IN_2) U12.9(VIN5)  [also labelled Sensor_In_7, TVS_7]
Sensor_8: C45.2 J10.G4 R42.2 U10.2(IN_3) U12.8(VIN3)  [also labelled Sensor_In_8, TVS_8]
Sensor_9: C43.2 J10.H1 R40.2 U10.3(IN_5) U12.7(VIN1)  [also labelled Sensor_In_9, TVS_9]
Sensor_10: C46.2 J10.G3 R43.2 U11.5(IN_4) U13.11(VIN8)  [also labelled Sensor_In_10, TVS_10]
TVS_11: U11.6(IN_6)
TVS_12: U11.7(IN)
VIN: D12.1(K) D14.1(K) NT3.2 NT4.2 R25.2 R29.2 R33.2 R37.2
VIN_Bat: J10.H4
NetJ11_IN: J11.IN(G) R44.2 R45.1
NetJ12_IN: J12.IN(G) R49.2 R50.1
NetR24_1: R24.1 R25.1 R26.2
NetR28_1: R28.1 R29.1 R30.2
NetR32_1: R32.1 R33.1 R34.2
NetR36_1: R36.1 R37.1 R38.2

Not connected (* = marked no-connect by the designer): J10 H2 H3 L3; U12 6(REFIN) 10(VIN7) 11(VIN8) 16(CONVST*) 17(ALERT/BUSY); U13 6(REFIN) 7(VIN1) 8(VIN3) 9(VIN5) 10(VIN7) 16(CONVST*) 17(ALERT/BUSY)

### Notes on the sheet
- Labels drawn without touching a wire or pin: 3.3V

### Library data of the parts
C42-C53 C83 C84 = 06035C104MAZ2A: as C1 on sheet ECU_Sheet; Package: None; Price: None; Value: *; MP: 06035C104MAZ2A; Availability: Unavailable
D12 D14 = SS54-HF: as D30 on sheet ECU_Sheet; SnapEDA_Link: https://www.snapeda.com/parts/SS54-HF/Comchip/view-part/?ref=snap; Package: DO-214AC-214 Comchip Technology; Value: *; MP: SS54-HF; Check_prices: https://www.snapeda.com/parts/SS54-HF/Comchip/view-part/?ref=eda
J11 J12 = IRLZ34N: N-Channel 55 V 30A (Tc) 3.8W (Ta), 68W (Tc) Surface Mount D2PAK; MF: Infineon; SnapEDA_Link: https://www.snapeda.com/parts/IRLZ34N/Infineon/view-part/?ref=snap; Package: TO-220 Infineon; Value: *; MP: IRLZ34N; Check_prices: https://www.snapeda.com/parts/IRLZ34N/Infineon/view-part/?ref=eda
Q2-Q5 = BSS138: N-Channel 50 V 220mA (Ta) 350mW (Ta) Surface Mount SOT-23-3; MF: onsemi; SnapEDA_Link: https://www.snapeda.com/parts/BSS138/Onsemi/view-part/?ref=snap; Package: SOT-23-3 ON Semiconductor; Value: *; MP: BSS138; Check_prices: https://www.snapeda.com/parts/BSS138/Onsemi/view-part/?ref=eda
R24-R43 R46-R48 R51-R53 = RC1206FR-074K7L: 4.7 kOhms Â±1% 0.25W, 1/4W Chip Resistor 1206 (3216 Metric) Moisture Resistant Thick Film; MF: Yageo; SnapEDA_Link: https://www.snapeda.com/parts/RC1206FR-074K7L/Yageo/view-part/?ref=snap; Package: 3116 Yageo; Value: *; MP: RC1206FR-074K7L; Check_prices: https://www.snapeda.com/parts/RC1206FR-074K7L/Yageo/view-part/?ref=eda
R44 R45 R49 R50 = AA1206JR-07470RL: Package: None; Price: None; Value: *; MP: AA1206JR-07470RL; Availability: Unavailable
U10 U11 = SP721ABTG: TVS Diode Arrays; Package: None; Price: None; Value: *; MP: SP721ABTG; Availability: Unavailable
U12 U13 = AD7997BRUZ-1REEL: Adc, 10-Bit, 188Ksps, Tssop-20; Resolution (Bits):10Bit; Sampling Rate:188Ksps; Input Channel Type:Single Ended; Data Interface:2 Wire, I2C; Supply Voltage Type:Single; Supply Voltage Min:2.7V; Supply Voltage Max:5.5V Rohs Compliant: Yes |Analog Devices A; MP: AD7997BRUZ1; SnapEDA_Link: https://www.snapeda.com/parts/AD7997BRUZ1/Analog+Devices/view-part/?ref=snap; Package: None; Value: *; MF: Analog Devices; Check_prices: https://www.snapeda.com/parts/AD7997BRUZ1/Analog+Devices/view-part/?ref=eda
D13 D15 = BZT52C3V3_RHG: Package: None; Price: None; Value: *; MP: BZT52C3V3_RHG; Availability: Unavailable
J10 = 5007620483: Package: None; Price: None; Value: *; MP: 5007620483; Availability: Unavailable

## Sheet Ignition_Injector.SchDoc
size 420 x 297 mm; SheetNumber: 4; SheetTotal: 5
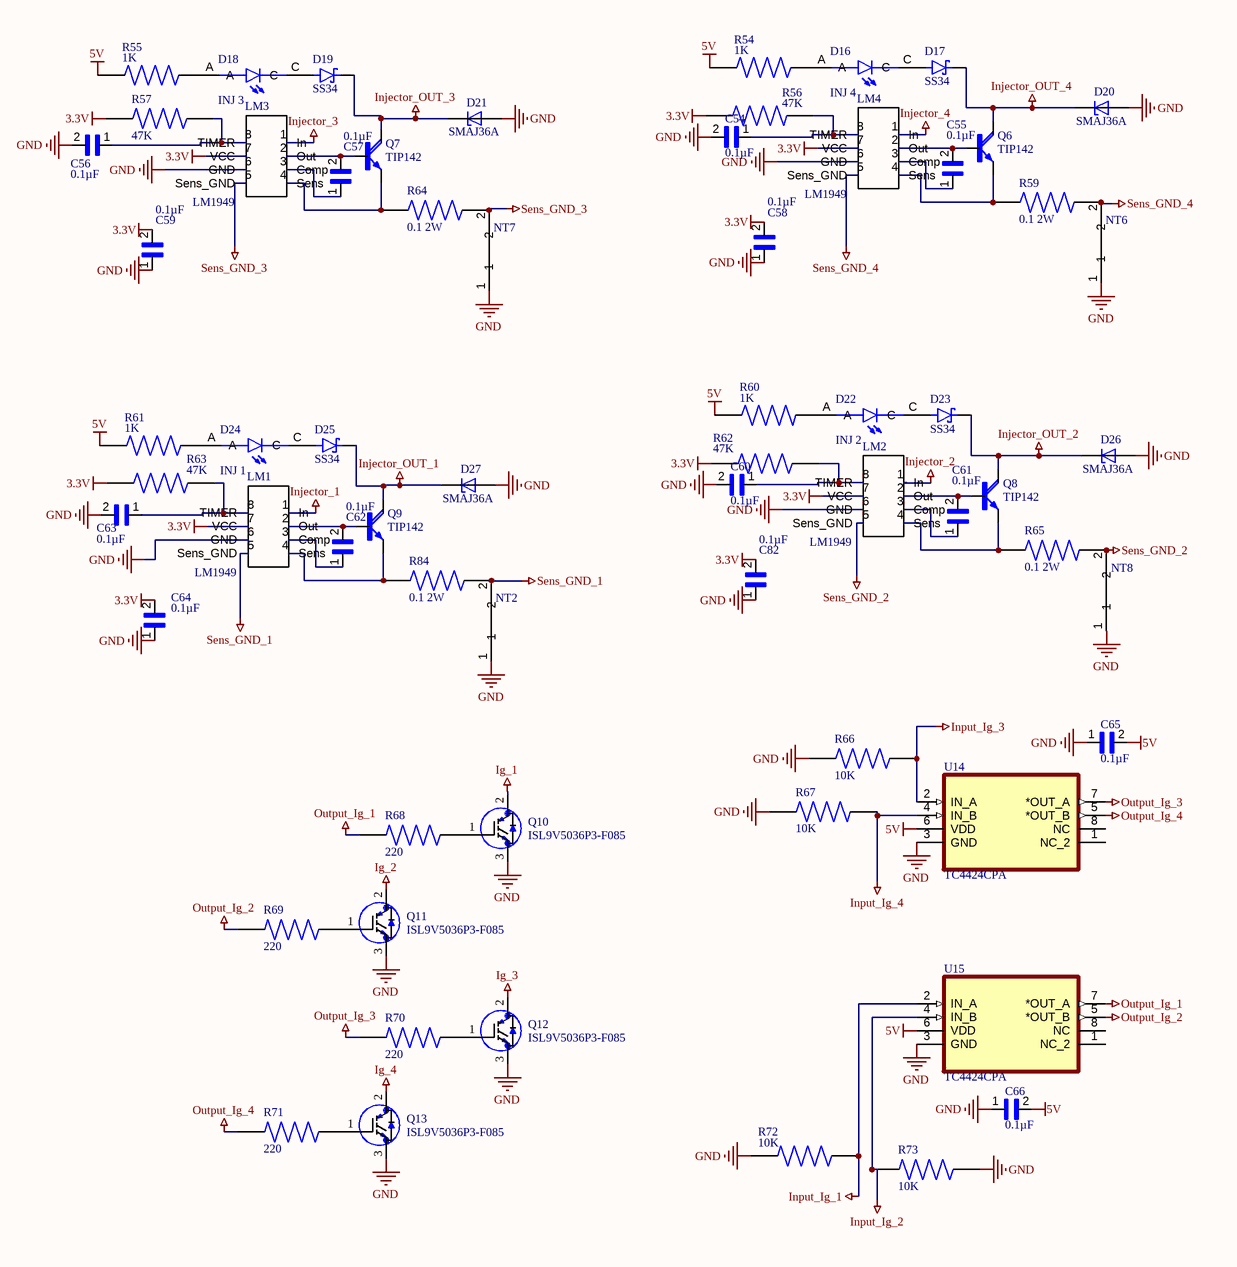
[diagram p4: Ignition_Injector.SchDoc]

### Parts
C54  0.1µF  [CAPC1608X90N]
C55  0.1µF  [CAPC1608X90N]
C56  0.1µF  [CAPC1608X90N]
C57  0.1µF  [CAPC1608X90N]
C58  0.1µF  [CAPC1608X90N]
C59  0.1µF  [CAPC1608X90N]
C60  0.1µF  [CAPC1608X90N]
C61  0.1µF  [CAPC1608X90N]
C62  0.1µF  [CAPC1608X90N]
C63  0.1µF  [CAPC1608X90N]
C64  0.1µF  [CAPC1608X90N]
C65  0.1µF  [CAPC1608X90N]
C66  0.1µF  [CAPC1608X90N]
C82  0.1µF  [CAPC1608X90N]
D16  INJ 4  [LEDC2012X70N]
D17  SS34  [DIO_SS34]
D18  INJ 3  [LEDC2012X70N]
D19  SS34  [DIO_SS34]
D20  SMAJ36A  [DIOM4325X250N]
D21  SMAJ36A  [DIOM4325X250N]
D22  INJ 2  [LEDC2012X70N]
D23  SS34  [DIO_SS34]
D24  INJ 1  [LEDC2012X70N]
D25  SS34  [DIO_SS34]
D26  SMAJ36A  [DIOM4325X250N]
D27  SMAJ36A  [DIOM4325X250N]
LM1  LM1949  [DIP794W45P254L959H508Q8]
LM2  LM1949  [DIP794W45P254L959H508Q8]
LM3  LM1949  [DIP794W45P254L959H508Q8]
LM4  LM1949  [DIP794W45P254L959H508Q8]
NT2  (no value)  [NetTie]  (net tie, no BOM)
NT6  (no value)  [NetTie]  (net tie, no BOM)
NT7  (no value)  [NetTie]  (net tie, no BOM)
NT8  (no value)  [NetTie]  (net tie, no BOM)
Q6  TIP142  [SOT93]
Q7  TIP142  [SOT93]
Q8  TIP142  [SOT93]
Q9  TIP142  [SOT93]
Q10  ISL9V5036P3-F085  [*TO254P470X1016X2019-3P]
Q11  ISL9V5036P3-F085  [*TO254P470X1016X2019-3P]
Q12  ISL9V5036P3-F085  [*TO254P470X1016X2019-3P]
Q13  ISL9V5036P3-F085  [*TO254P470X1016X2019-3P]
R54  1K  [RESC3116X65N]
R55  1K  [RESC3116X65N]
R56  47K  [RESC3116X65N]
R57  47K  [RESC3116X65N]
R59  0.1 2W  [RESC6331X80N]
R60  1K  [RESC3116X65N]
R61  1K  [RESC3116X65N]
R62  47K  [RESC3116X65N]
R63  47K  [RESC3116X65N]
R64  0.1 2W  [RESC6331X80N]
R65  0.1 2W  [RESC6331X80N]
R66  10K  [RESC3116X65N]
R67  10K  [RESC3116X65N]
R68  220  [RES_ERJP08J221V]
R69  220  [RES_ERJP08J221V]
R70  220  [RES_ERJP08J221V]
R71  220  [RES_ERJP08J221V]
R72  10K  [RESC3116X65N]
R73  10K  [RESC3116X65N]
R84  0.1 2W  [RESC6331X80N]
U14  TC4424CPA  [DIP254P762X432-8]
U15  TC4424CPA  [DIP254P762X432-8]

### Nets
3.3V: C58.2 C59.2 C64.2 C82.2 LM1.7(VCC) LM2.7(VCC) LM3.7(VCC) LM4.7(VCC) R56.1 R57.1 R62.1 R63.1
5V: C65.2 C66.2 R54.1 R55.1 R60.1 R61.1 U14.6(VDD) U15.6(VDD)
GND: C54.2 C56.2 C58.1 C59.1 C60.2 C63.2 C64.1 C65.1 C66.1 C82.1 D20.A D21.A D26.A D27.A LM1.6(GND) LM2.6(GND) LM3.6(GND) LM4.6(GND) NT2.1 NT6.1 NT7.1 NT8.1 Q10.3(E) Q11.3(E) Q12.3(E) Q13.3(E) R66.1 R67.1 R72.1 R73.1 U14.3(GND) U15.3(GND)
Ig_1: Q10.2(C)
Ig_2: Q11.2(C)
Ig_3: Q12.2(C)
Ig_4: Q13.2(C)
Injector_1: LM1.1(In)
Injector_2: LM2.1(In)
Injector_3: LM3.1(In)
Injector_4: LM4.1(In)
Injector_OUT_1: D25.C(K) D27.C Q9.C
Injector_OUT_2: D23.C(K) D26.C Q8.C
Injector_OUT_3: D19.C(K) D21.C Q7.C
Injector_OUT_4: D17.C(K) D20.C Q6.C
Input_Ig_1: R72.2 U15.2(IN_A)
Input_Ig_2: R73.2 U15.4(IN_B)
Input_Ig_3: R66.2 U14.2(IN_A)
Input_Ig_4: R67.2 U14.4(IN_B)
Output_Ig_1: R68.1 U15.7(*OUT_A)
Output_Ig_2: R69.1 U15.5(*OUT_B)
Output_Ig_3: R70.1 U14.7(*OUT_A)
Output_Ig_4: R71.1 U14.5(*OUT_B)
Sens_GND_1: LM1.5(Sens_GND) NT2.2 R84.2
Sens_GND_2: LM2.5(Sens_GND) NT8.2 R65.2
Sens_GND_3: LM3.5(Sens_GND) NT7.2 R64.1
Sens_GND_4: LM4.5(Sens_GND) NT6.2 R59.2
NetC54_1: C54.1 LM4.8(TIMER) R56.2
NetC55_1: C55.1 LM4.3(Comp)
NetC55_2: C55.2 LM4.2(Out) Q6.B
NetC56_1: C56.1 LM3.8(TIMER) R57.2
NetC57_1: C57.1 LM3.3(Comp)
NetC57_2: C57.2 LM3.2(Out) Q7.B
NetC60_1: C60.1 LM2.8(TIMER) R62.2
NetC61_1: C61.1 LM2.3(Comp)
NetC61_2: C61.2 LM2.2(Out) Q8.B
NetC62_1: C62.1 LM1.3(Comp)
NetC62_2: C62.2 LM1.2(Out) Q9.B
NetC63_1: C63.1 LM1.8(TIMER) R63.2
NetD16_A: D16.A R54.2
NetD16_C: D16.C D17.A
NetD18_A: D18.A R55.2
NetD18_C: D18.C D19.A
NetD22_A: D22.A R60.2
NetD22_C: D22.C D23.A
NetD24_A: D24.A R61.2
NetD24_C: D24.C D25.A
NetLM1_4: LM1.4(Sens) Q9.E R84.1
NetLM2_4: LM2.4(Sens) Q8.E R65.1
NetLM3_4: LM3.4(Sens) Q7.E R64.2
NetLM4_4: LM4.4(Sens) Q6.E R59.1
NetQ10_1: Q10.1(G) R68.2
NetQ11_1: Q11.1(G) R69.2
NetQ12_1: Q12.1(G) R70.2
NetQ13_1: Q13.1(G) R71.2

Not connected (* = marked no-connect by the designer): U14 1(NC_2) 8(NC); U15 1(NC_2) 8(NC)

### Notes on the sheet
- THIS DOCUMENT AND THE DATA DISCLOSED HEREIN OR
- HEREWITH IS THE PROPERTY OF ALTIUM LIMITED AND MAY
- DWG NO:
- REVISION
- REV:
- DESCRIPTION
- DATE
- APPROVED
- BE FREELY DISTRIBUTED IN WHOLE. NO RIGHTS ARE
- RESERVED OR EXPRESS OR IMPLIED WARANTEE GIVEN.
- ENG:
- APPROVALS
- PROJECT
- DSN:
- CHK:
- REFERENCE DOCUMENTS
- PROJECT REVISION:
- TITLE
- DOCUMENT REVISION:
- DESIGN ITEM:
- BOM:
- FAB DWG:
- PCB DWG:
- ASSY DWG:
- SCALE:
- A3
- SIZE
- CAGE CODE
- FILE NAME
- DWG NO.
- SHEET
- OF
- REV

### Library data of the parts
C54-C66 C82 = 06035C104MAZ2A: as C1 on sheet ECU_Sheet; Package: None; Price: None; Value: *; MP: 06035C104MAZ2A; Availability: Unavailable
D16 D18 D22 D24 = 597-3305-607F: LED Uni-Color Green 4-Pin Chip 0805 T/R; Availability: Unavailable; Value: *; Price: None; MP: 597-3305-607F; Package: None
D17 D19 D23 D25 = SS34: as D4 on sheet Communication_Interfaces; SnapEDA_Link: https://www.snapeda.com/parts/SS34/Taiwan+Semiconductor/view-part/?ref=snap; Package: DO-214AB-2 Taiwan Semiconductor; Value: *; MP: SS34; Check_prices: https://www.snapeda.com/parts/SS34/Taiwan+Semiconductor/view-part/?ref=eda
D20 D21 D26 D27 = SMAJ36A: 400W Surface Mount Transient Voltage Supressors | Littelfuse SMAJ36A; SnapEDA_Link: https://www.snapeda.com/parts/SMAJ36A/Littelfuse/view-part/?ref=snap; Package: DO-214 Bourns; Value: *; MF: Littelfuse; MP: SMAJ36A; Check_prices: https://www.snapeda.com/parts/SMAJ36A/Littelfuse/view-part/?ref=eda
LM1-LM4 = Component_1
NT2 NT6-NT8 = NT
Q6-Q9 = TIP142: Bipolar (BJT) Transistor NPN - Darlington 100 V 10 A - 125 W Through Hole TO-247-3; MF: ON Semiconductor; SnapEDA_Link: https://www.snapeda.com/parts/TIP142/Onsemi/view-part/?ref=snap; Package: SOT-93-3 ON Semiconductor; Value: *; MP: TIP142; Check_prices: https://www.snapeda.com/parts/TIP142/Onsemi/view-part/?ref=eda
R54 R55 R60 R61 = RC1206JR-071KL: as R14 on sheet Communication_Interfaces; SnapEDA_Link: https://www.snapeda.com/parts/RC1206JR071KL/Yageo/view-part/?ref=snap; Package: 1206-2 YAGEO; Value: *; Check_prices: https://www.snapeda.com/parts/RC1206JR071KL/Yageo/view-part/?ref=eda
R56 R57 R62 R63 R66 R67 R72 R73 = AA1206JR-07470RL: Package: None; Price: None; Value: *; MP: AA1206JR-07470RL; Availability: Unavailable
R59 R64 R65 R84 = CRM2512-JX-R100ELF: as R58 on sheet ECU_Sheet; SnapEDA_Link: https://www.snapeda.com/parts/CRM2512-JX-R100ELF/Bourns/view-part/?ref=snap; Package: 6331 Bourns; Value: *; MF: Bourns; MP: CRM2512-JX-R100ELF; Check_prices: https://www.snapeda.com/parts/CRM2512-JX-R100ELF/Bourns/view-part/?ref=eda
R68-R71 = ERJP08J221V: Value: *; Price: None; Availability: Unavailable; Package: None; MP: ERJP08J221V
U14 U15 = TC4424CPA: Dual MOSFET Power Driver 3A 4.5 to 18V Non-Inverting 8-Pin PDIP | Microchip Technology Inc. TC4424CPA; SnapEDA_Link: https://www.snapeda.com/parts/TC4424CPA/Microchip/view-part/?ref=snap; Package: DIP-8 Microchip; Value: *; MF: Microchip; MP: TC4424CPA; Check_prices: https://www.snapeda.com/parts/TC4424CPA/Microchip/view-part/?ref=eda
Q10-Q13 = ISL9V5036P3-F085: SnapEDA_Link: https://www.snapeda.com/parts/ISL9V5036P3-F085/Onsemi/view-part/?ref=snap; Check_prices: https://www.snapeda.com/parts/ISL9V5036P3-F085/Onsemi/view-part/?ref=eda; Value: *

## Sheet CKP_CMP.SchDoc
size 420 x 297 mm; SheetNumber: 5; SheetTotal: 5
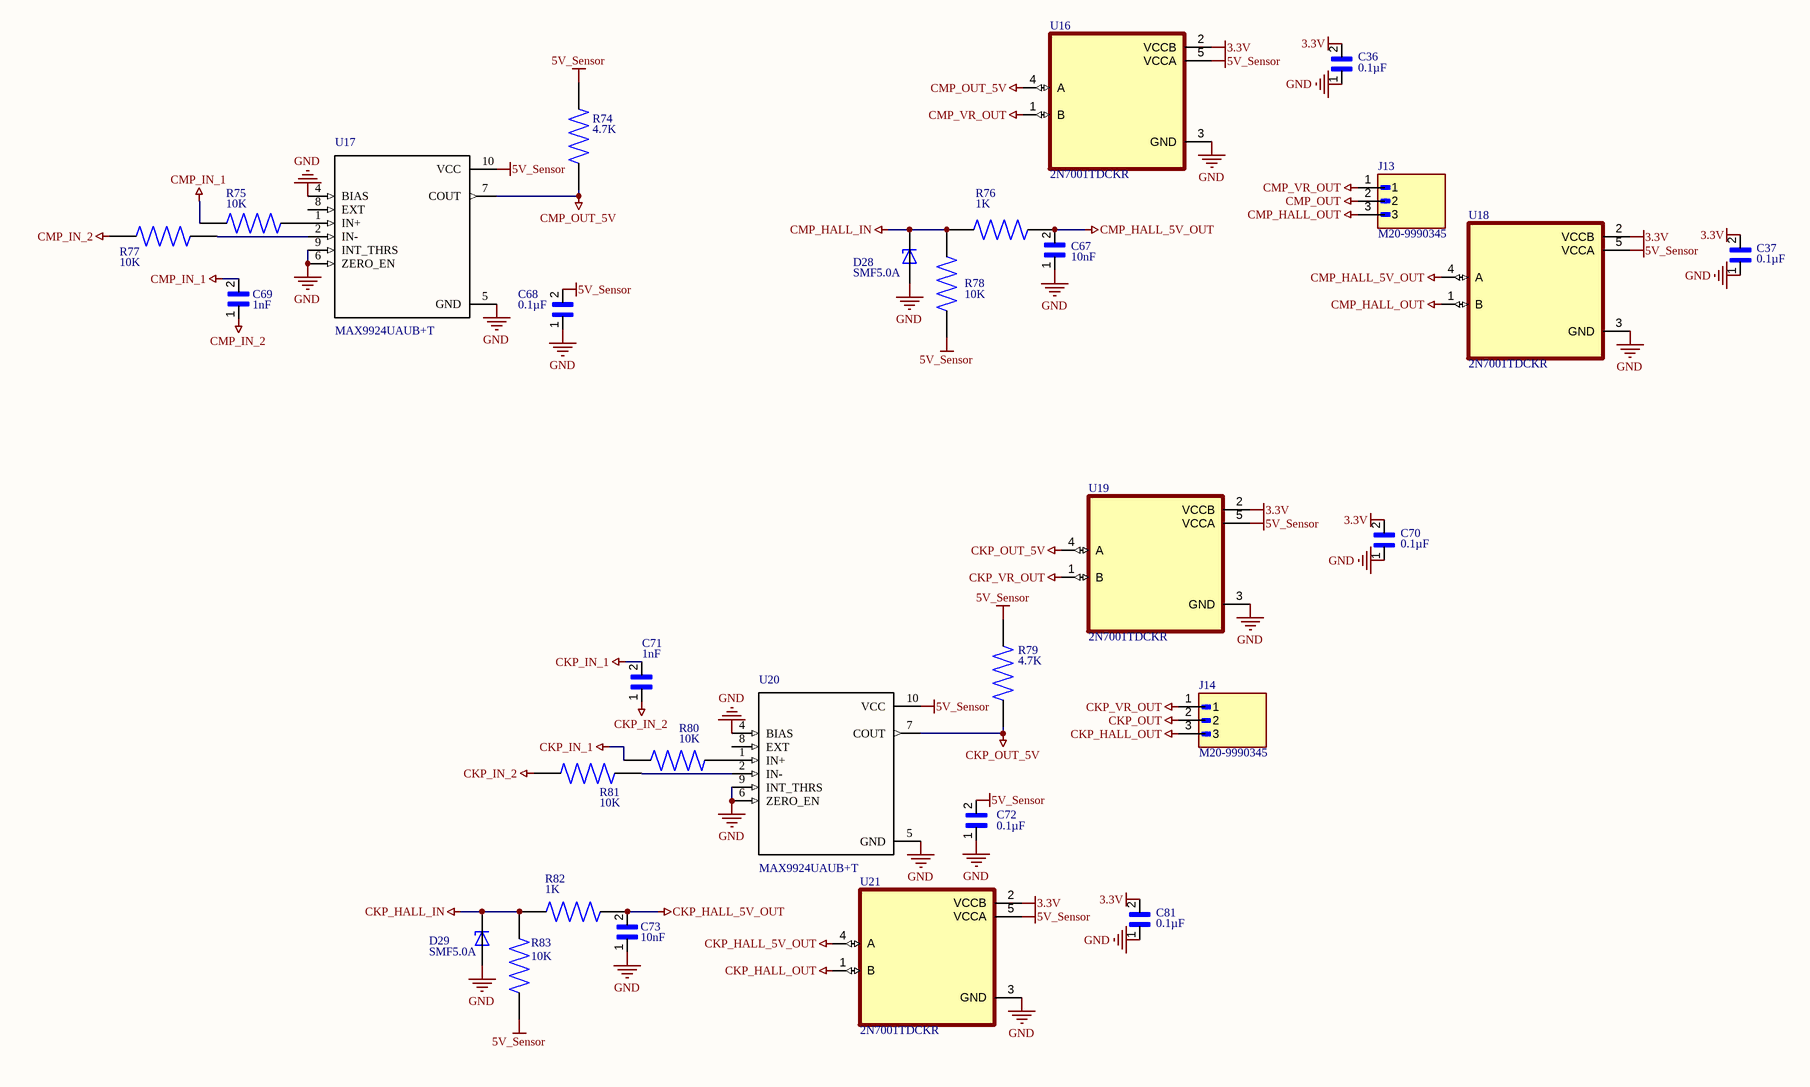
[diagram p5: CKP_CMP.SchDoc]

### Parts
C36  0.1µF  [CAPC1608X90N]
C37  0.1µF  [CAPC1608X90N]
C67  10nF  [CAPC1608X90N]
C68  0.1µF  [CAPC1608X90N]
C69  1nF  [CAPC1608X90N]
C70  0.1µF  [CAPC1608X90N]
C71  1nF  [CAPC1608X90N]
C72  0.1µF  [CAPC1608X90N]
C73  10nF  [CAPC1608X90N]
C81  0.1µF  [CAPC1608X90N]
D28  SMF5.0A  [SODFL3718X102N]
D29  SMF5.0A  [SODFL3718X102N]
J13  M20-9990345  [HARWIN_M20-9990345]
J14  M20-9990345  [HARWIN_M20-9990345]
R74  4.7K  [RESC3116X65N]
R75  10K  [RESC3116X65N]
R76  1K  [RESC3116X65N]
R77  10K  [RESC3116X65N]
R78  10K  [RESC3116X65N]
R79  4.7K  [RESC3116X65N]
R80  10K  [RESC3116X65N]
R81  10K  [RESC3116X65N]
R82  1K  [RESC3116X65N]
R83  10K  [RESC3116X65N]
U16  2N7001TDCKR  [SOT65P210X110-5N]
U17  MAX9924UAUB+T  [*SOP50P490X110-10N]
U18  2N7001TDCKR  [SOT65P210X110-5N]
U19  2N7001TDCKR  [SOT65P210X110-5N]
U20  MAX9924UAUB+T  [*SOP50P490X110-10N]
U21  2N7001TDCKR  [SOT65P210X110-5N]

### Nets
3.3V: C36.2 C37.2 C70.2 C81.2 U16.2(VCCB) U18.2(VCCB) U19.2(VCCB) U21.2(VCCB)
5V_Sensor: C68.2 C72.2 R74.2 R78.1 R79.2 R83.1 U16.5(VCCA) U17.10(VCC) U18.5(VCCA) U19.5(VCCA) U20.10(VCC) U21.5(VCCA)
CKP_HALL_5V_OUT: C73.2 R82.1 U21.4(A)
CKP_HALL_IN: D29.C R82.2 R83.2
CKP_HALL_OUT: J14.3 U21.1(B)
CKP_IN_1: C71.2 R80.1
CKP_IN_2: C71.1 R81.1
CKP_OUT: J14.2
CKP_OUT_5V: R79.1 U19.4(A) U20.7(COUT)
CKP_VR_OUT: J14.1 U19.1(B)
CMP_HALL_5V_OUT: C67.2 R76.1 U18.4(A)
CMP_HALL_IN: D28.C R76.2 R78.2
CMP_HALL_OUT: J13.3 U18.1(B)
CMP_IN_1: C69.2 R75.1
CMP_IN_2: C69.1 R77.1
CMP_OUT: J13.2
CMP_OUT_5V: R74.1 U16.4(A) U17.7(COUT)
CMP_VR_OUT: J13.1 U16.1(B)
GND: C36.1 C37.1 C67.1 C68.1 C70.1 C72.1 C73.1 C81.1 D28.A D29.A U16.3(GND) U17.4(BIAS) U17.5(GND) U17.6(ZERO_EN) U17.9(INT_THRS) U18.3(GND) U19.3(GND) U20.4(BIAS) U20.5(GND) U20.6(ZERO_EN) U20.9(INT_THRS) U21.3(GND)
NetR75_2: R75.2 U17.1(IN+)
NetR77_2: R77.2 U17.2(IN-)
NetR80_2: R80.2 U20.1(IN+)
NetR81_2: R81.2 U20.2(IN-)

Not connected (* = marked no-connect by the designer): U17 8(EXT); U20 8(EXT)

### Notes on the sheet
- THIS DOCUMENT AND THE DATA DISCLOSED HEREIN OR
- HEREWITH IS THE PROPERTY OF ALTIUM LIMITED AND MAY
- DWG NO:
- REVISION
- REV:
- DESCRIPTION
- DATE
- APPROVED
- BE FREELY DISTRIBUTED IN WHOLE. NO RIGHTS ARE
- RESERVED OR EXPRESS OR IMPLIED WARANTEE GIVEN.
- ENG:
- APPROVALS
- PROJECT
- DSN:
- CHK:
- REFERENCE DOCUMENTS
- PROJECT REVISION:
- TITLE
- DOCUMENT REVISION:
- DESIGN ITEM:
- BOM:
- FAB DWG:
- PCB DWG:
- ASSY DWG:
- SCALE:
- A3
- SIZE
- CAGE CODE
- FILE NAME
- DWG NO.
- SHEET
- OF
- REV

### Library data of the parts
C36 C37 C67-C73 C81 = 06035C104MAZ2A: as C1 on sheet ECU_Sheet; Package: None; Price: None; Value: *; MP: 06035C104MAZ2A; Availability: Unavailable
D28 D29 = SMF5.0A: as D1 on sheet ECU_Sheet; SnapEDA_Link: https://www.snapeda.com/parts/SMF5.0A/taiwan/view-part/?ref=snap; Package: SOD-123W-2 Taiwan Semiconductor; Value: *; MP: SMF5.0A; Check_prices: https://www.snapeda.com/parts/SMF5.0A/taiwan/view-part/?ref=eda
J13 J14 = M20-9990345: 2.54mm (0.1) Pitch SIL Vertical Throughboard Pin Header, 6.1mm mating pin height, gold (hi-temp mould), 3 contacts; MF: Harwin; SnapEDA_Link: https://www.snapeda.com/parts/M20-9990345/Harwin+Inc./view-part/?ref=snap; Package: None; Value: *; MP: M20-9990345; Check_prices: https://www.snapeda.com/parts/M20-9990345/Harwin+Inc./view-part/?ref=eda
R74-R83 = AA1206JR-07470RL: Package: None; Price: None; Value: *; MP: AA1206JR-07470RL; Availability: Unavailable
U16 U18 U19 U21 = 2N7001TDCKR: as U3 on sheet ECU_Sheet; SnapEDA_Link: https://www.snapeda.com/parts/2N7001TDCKR/Texas+Instruments/view-part/?ref=snap; Package: SC70-5 Texas Instruments; Value: *; MP: 2N7001TDCKR; Check_prices: https://www.snapeda.com/parts/2N7001TDCKR/Texas+Instruments/view-part/?ref=eda
U17 U20 = MAX9924UAUB+T: SnapEDA_Link: https://www.snapeda.com/parts/MAX9924UAUB+T/Maxim+Integrated/view-part/?ref=snap; Check_prices: https://www.snapeda.com/parts/MAX9924UAUB+T/Maxim+Integrated/view-part/?ref=eda; Value: *

## Nets that join several sheets
3.3V: ECU_Sheet (23 pins), Communication_Interfaces (18 pins), Outputs_Sensors_And_ECUConnector (9 pins), Ignition_Injector (12 pins), CKP_CMP (8 pins)
5V: ECU_Sheet (C21.2 D1.C FL1.1), Communication_Interfaces (11 pins), Outputs_Sensors_And_ECUConnector (R24.2 R28.2 R32.2 R36.2), Ignition_Injector (8 pins)
5V_Sensor: ECU_Sheet (11 pins), Outputs_Sensors_And_ECUConnector (22 pins), CKP_CMP (12 pins)
CANH: Communication_Interfaces (RCAN1.2 U7.7), Outputs_Sensors_And_ECUConnector (J10.B3)
CANL: Communication_Interfaces (RCAN1.1 U7.6), Outputs_Sensors_And_ECUConnector (J10.B2)
CANRX: ECU_Sheet (U1.81), Communication_Interfaces (U7.4)
CANTX: ECU_Sheet (U1.82), Communication_Interfaces (U7.1)
CJ125_DIAHD: ECU_Sheet (D30.2 Q1.2 R4.1 R88.2), Outputs_Sensors_And_ECUConnector (J10.J1)
CJ125_IA: ECU_Sheet (R8.1 R85.1 U2.4), Outputs_Sensors_And_ECUConnector (J10.K1)
CJ125_IP: ECU_Sheet (R8.2 U2.3), Outputs_Sensors_And_ECUConnector (J10.K2)
CJ125_UN: ECU_Sheet (C11.1 R87.2 U2.2), Outputs_Sensors_And_ECUConnector (J10.J2)
CJ125_VM: ECU_Sheet (U2.18), Outputs_Sensors_And_ECUConnector (J10.J3)
CKP_HALL_IN: Outputs_Sensors_And_ECUConnector (J10.F3), CKP_CMP (D29.C R82.2 R83.2)
CKP_IN_1: Outputs_Sensors_And_ECUConnector (J10.G2), CKP_CMP (C71.2 R80.1)
CKP_IN_2: Outputs_Sensors_And_ECUConnector (J10.F2), CKP_CMP (C71.1 R81.1)
CKP_OUT: ECU_Sheet (U1.22), CKP_CMP (J14.2)
CMP_HALL_IN: Outputs_Sensors_And_ECUConnector (J10.D3), CKP_CMP (D28.C R76.2 R78.2)
CMP_IN_1: Outputs_Sensors_And_ECUConnector (J10.D2), CKP_CMP (C69.2 R75.1)
CMP_IN_2: Outputs_Sensors_And_ECUConnector (J10.E2), CKP_CMP (C69.1 R77.1)
CMP_OUT: ECU_Sheet (U1.23), CKP_CMP (J13.2)
D+_CH: ECU_Sheet (U1.71), Communication_Interfaces (D31.3)
D-_CH: ECU_Sheet (U1.70), Communication_Interfaces (D31.1)
DATA_0: ECU_Sheet (U1.65), Communication_Interfaces (J7.7)
DATA_1: ECU_Sheet (U1.66), Communication_Interfaces (J7.8)
DATA_2: ECU_Sheet (U1.78), Communication_Interfaces (J7.1)
DATA_3: ECU_Sheet (U1.79), Communication_Interfaces (J7.2)
GND: ECU_Sheet (59 pins), Communication_Interfaces (40 pins), Outputs_Sensors_And_ECUConnector (32 pins), Ignition_Injector (32 pins), CKP_CMP (22 pins)
Ig_1: Outputs_Sensors_And_ECUConnector (J10.M4), Ignition_Injector (Q10.2)
Ig_2: Outputs_Sensors_And_ECUConnector (J10.M3), Ignition_Injector (Q11.2)
Ig_3: Outputs_Sensors_And_ECUConnector (J10.M2), Ignition_Injector (Q12.2)
Ig_4: Outputs_Sensors_And_ECUConnector (J10.M1), Ignition_Injector (Q13.2)
Injector_1: ECU_Sheet (U1.39), Ignition_Injector (LM1.1)
Injector_2: ECU_Sheet (U1.41), Ignition_Injector (LM2.1)
Injector_3: ECU_Sheet (U1.43), Ignition_Injector (LM3.1)
Injector_4: ECU_Sheet (U1.44), Ignition_Injector (LM4.1)
Injector_OUT_1: Outputs_Sensors_And_ECUConnector (J10.A1), Ignition_Injector (D25.C D27.C Q9.C)
Injector_OUT_2: Outputs_Sensors_And_ECUConnector (J10.A4), Ignition_Injector (D23.C D26.C Q8.C)
Injector_OUT_3: Outputs_Sensors_And_ECUConnector (J10.A3), Ignition_Injector (D19.C D21.C Q7.C)
Injector_OUT_4: Outputs_Sensors_And_ECUConnector (J10.A2), Ignition_Injector (D17.C D20.C Q6.C)
Input_Ig_1: ECU_Sheet (U1.59), Ignition_Injector (R72.2 U15.2)
Input_Ig_2: ECU_Sheet (U1.60), Ignition_Injector (R73.2 U15.4)
Input_Ig_3: ECU_Sheet (U1.61), Ignition_Injector (R66.2 U14.2)
Input_Ig_4: ECU_Sheet (U1.62), Ignition_Injector (R67.2 U14.4)
JTDI: ECU_Sheet (U1.77), Communication_Interfaces (J9.06)
LAMBDA_H+: ECU_Sheet (NT1.1), Outputs_Sensors_And_ECUConnector (J10.J4)
MAP_OUT: ECU_Sheet (C23.2 MAP1.4 R9.1 U1.16), Outputs_Sensors_And_ECUConnector (J10.K3)
nRESET: ECU_Sheet (5 pins), Communication_Interfaces (J9.10)
PWM_MCU_OUT_1: ECU_Sheet (U1.5), Outputs_Sensors_And_ECUConnector (Q2.2 R27.1)
PWM_MCU_OUT_2: ECU_Sheet (U1.4), Outputs_Sensors_And_ECUConnector (Q3.2 R31.1)
PWM_MCU_OUT_3: ECU_Sheet (U1.91), Outputs_Sensors_And_ECUConnector (Q4.2 R35.1)
PWM_MCU_OUT_4: ECU_Sheet (U1.24), Outputs_Sensors_And_ECUConnector (Q5.2 R39.1)
SCL_1: ECU_Sheet (U1.92), Communication_Interfaces (R17.2), Outputs_Sensors_And_ECUConnector (U12.19 U13.19)
SCL_2: ECU_Sheet (U1.46), Communication_Interfaces (J8.02 R19.2 U9.6)
SD_CK: ECU_Sheet (U1.80), Communication_Interfaces (J7.5)
SD_CMD: ECU_Sheet (U1.83), Communication_Interfaces (J7.3)
SDA_1: ECU_Sheet (U1.93), Communication_Interfaces (R16.1), Outputs_Sensors_And_ECUConnector (U12.18 U13.18)
SDA_2: ECU_Sheet (U1.47), Communication_Interfaces (J8.01 R18.1 U9.5)
SWCLK: ECU_Sheet (U1.76), Communication_Interfaces (J9.04)
SWDIO: ECU_Sheet (U1.72), Communication_Interfaces (J9.02)
SWO: ECU_Sheet (U1.89), Communication_Interfaces (J9.07)
UART_1_RX: ECU_Sheet (U1.54), Communication_Interfaces (D9.C J5.05)
UART_1_TX: ECU_Sheet (U1.53), Communication_Interfaces (D8.C J5.03)
UART_2_RX: ECU_Sheet (U1.56), Communication_Interfaces (D11.C J5.06)
UART_2_TX: ECU_Sheet (U1.55), Communication_Interfaces (D10.C J5.04)
VIN: ECU_Sheet (5 pins), Communication_Interfaces (6 pins), Outputs_Sensors_And_ECUConnector (8 pins)
VIN_Bat: Communication_Interfaces (J3.1 X2.2A X2.2B), Outputs_Sensors_And_ECUConnector (J10.H4)